# Altium project obdh2_project.prjpcb (part 1 of 2)
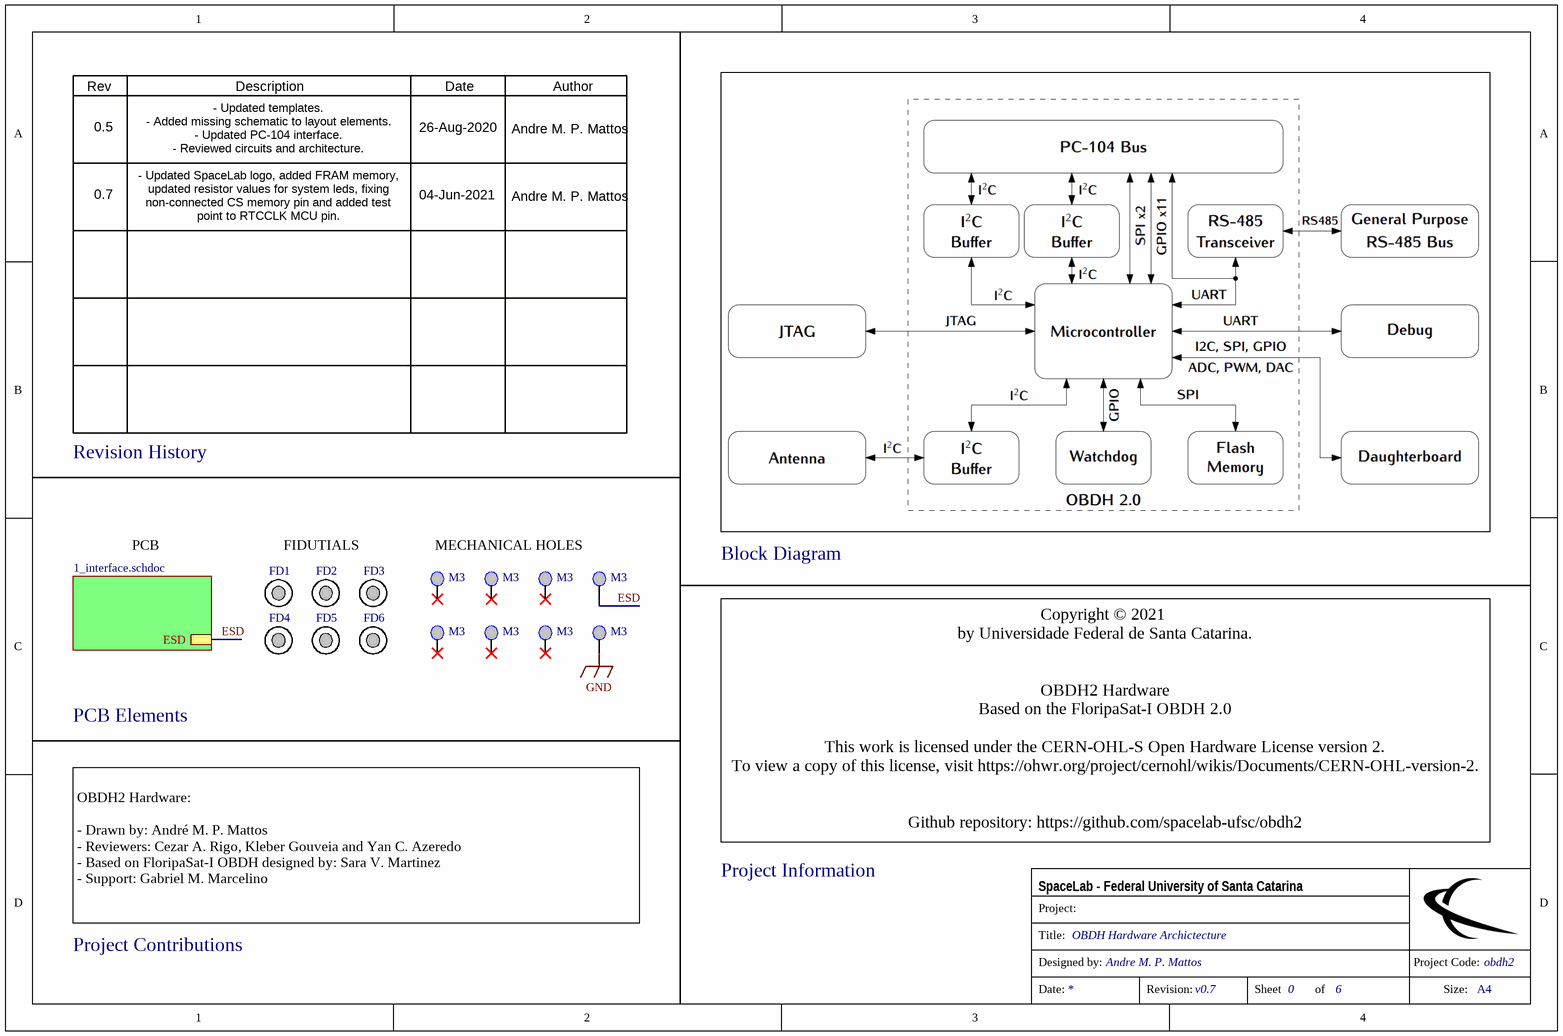
[diagram p0: 0_architecture.schdoc]
DesignedBy: Andre M. P. Mattos; ProductCode: OBDH2; Revision: 0.7
7 sheets, 199 parts. Net scope: hierarchical (ports join the sheet entries above them; power ports are global).
Board file: board_layout.pcbdoc
Sheets:
  0_architecture.schdoc
    Interface = 1_interface.schdoc
      Topology = 2_topology.schdoc
        MCU_OBDH = 3_mcu_main.schdoc
        Analog_Circuits = 4_analog_circuits.schdoc
        Non Volatile Memory = 5_non_volatile_memory.schdoc
        Communication Buffers = 6_communication_buffers.schdoc

## Sheet 0_architecture.schdoc: OBDH Hardware Archictecture
size A4; Revision: v0.7; SheetNumber: 0; SheetTotal: 6; ProjectCode: obdh2; Designed by: André M. P. Mattos; Version: v0.7

### Parts
FD1  Fiducial 1.3  [Fiducial 1.3mm]  (value not drawn)  (no BOM)
FD2  Fiducial 1.3  [Fiducial 1.3mm]  (value not drawn)  (no BOM)
FD3  Fiducial 1.3  [Fiducial 1.3mm]  (value not drawn)  (no BOM)
FD4  Fiducial 1.3  [Fiducial 1.3mm]  (value not drawn)  (no BOM)
FD5  Fiducial 1.3  [Fiducial 1.3mm]  (value not drawn)  (no BOM)
FD6  Fiducial 1.3  [Fiducial 1.3mm]  (value not drawn)  (no BOM)
MEC1  M3  [M3 hole]  (no BOM)
MEC2  M3  [M3 hole]  (no BOM)
MEC3  M3  [M3 hole]  (no BOM)
MEC4  M3  [M3 hole]  (no BOM)
MEC5  M3  [M3 hole]  (no BOM)
MEC6  M3  [M3 hole]  (no BOM)
MEC7  M3  [M3 hole]  (no BOM)
MEC8  M3  [M3 hole]  (no BOM)

### Sub-sheets
Interface = 1_interface.schdoc: ESD

### Nets
GND: MEC8.0
ESD: MEC4.0 ; sheet Interface/ESD

Not connected (* = marked no-connect by the designer): MEC1 0*; MEC2 0*; MEC3 0*; MEC5 0*; MEC6 0*; MEC7 0*

### Notes on the sheet
- Rev
- Description
- Date
- Author
- 0.5
- - Updated templates.
  - Added missing schematic to layout elements.
  - Updated PC-104 interface.
  - Reviewed circuits and architecture.
- 26-Aug-2020
- Andre M. P. Mattos
- 0.7
- - Updated SpaceLab logo, added FRAM memory, updated resistor values for system leds, fixing non-connected CS memory pin and added test point to RTCCLK MCU pin.
- 04-Jun-2021
- Revision History
- PCB
- FIDUTIALS
- MECHANICAL HOLES
- Block Diagram
- PCB Elements
- Copyright © 2021
  by Universidade Federal de Santa Catarina.
  OBDH2 Hardware
  Based on the FloripaSat-I OBDH 2.0
  This work is licensed under the CERN-OHL-S Open Hardware License version 2.
  To view a copy of this license, visit https://ohwr.org/project/cernohl/wikis/Documents/CERN-OHL-version-2.
  Github repository: https://github.com/spacelab-ufsc/obdh2
  More info about SpaceLab: https://spacelab.ufsc.br/
- OBDH2 Hardware:
  - Drawn by: André M. P. Mattos
  - Reviewers: Cezar A. Rigo, Kleber Gouveia and Yan C. Azeredo
  - Based on FloripaSat-I OBDH designed by: Sara V. Martinez
  - Support: Gabriel M. Marcelino
- Project Information
- Project Contributions
- Project:
- SpaceLab - Federal University of Santa Catarina
- Title:
- Designed by:
- Project Code:
- Date:
- Revision:
- Sheet
- of
- Size:
- A4

### Library data of the parts
FD1-FD6 = Fiducial 1.3: Fiducial 1.3mm
MEC1-MEC8 = M3 hole

## Sheet 1_interface.schdoc: OBDH Interface
size A3; Engineer: Eng_2_ALT; SheetNumber: 1; SheetTotal: 6; Designed by: André M. P. Mattos; Version: v0.5
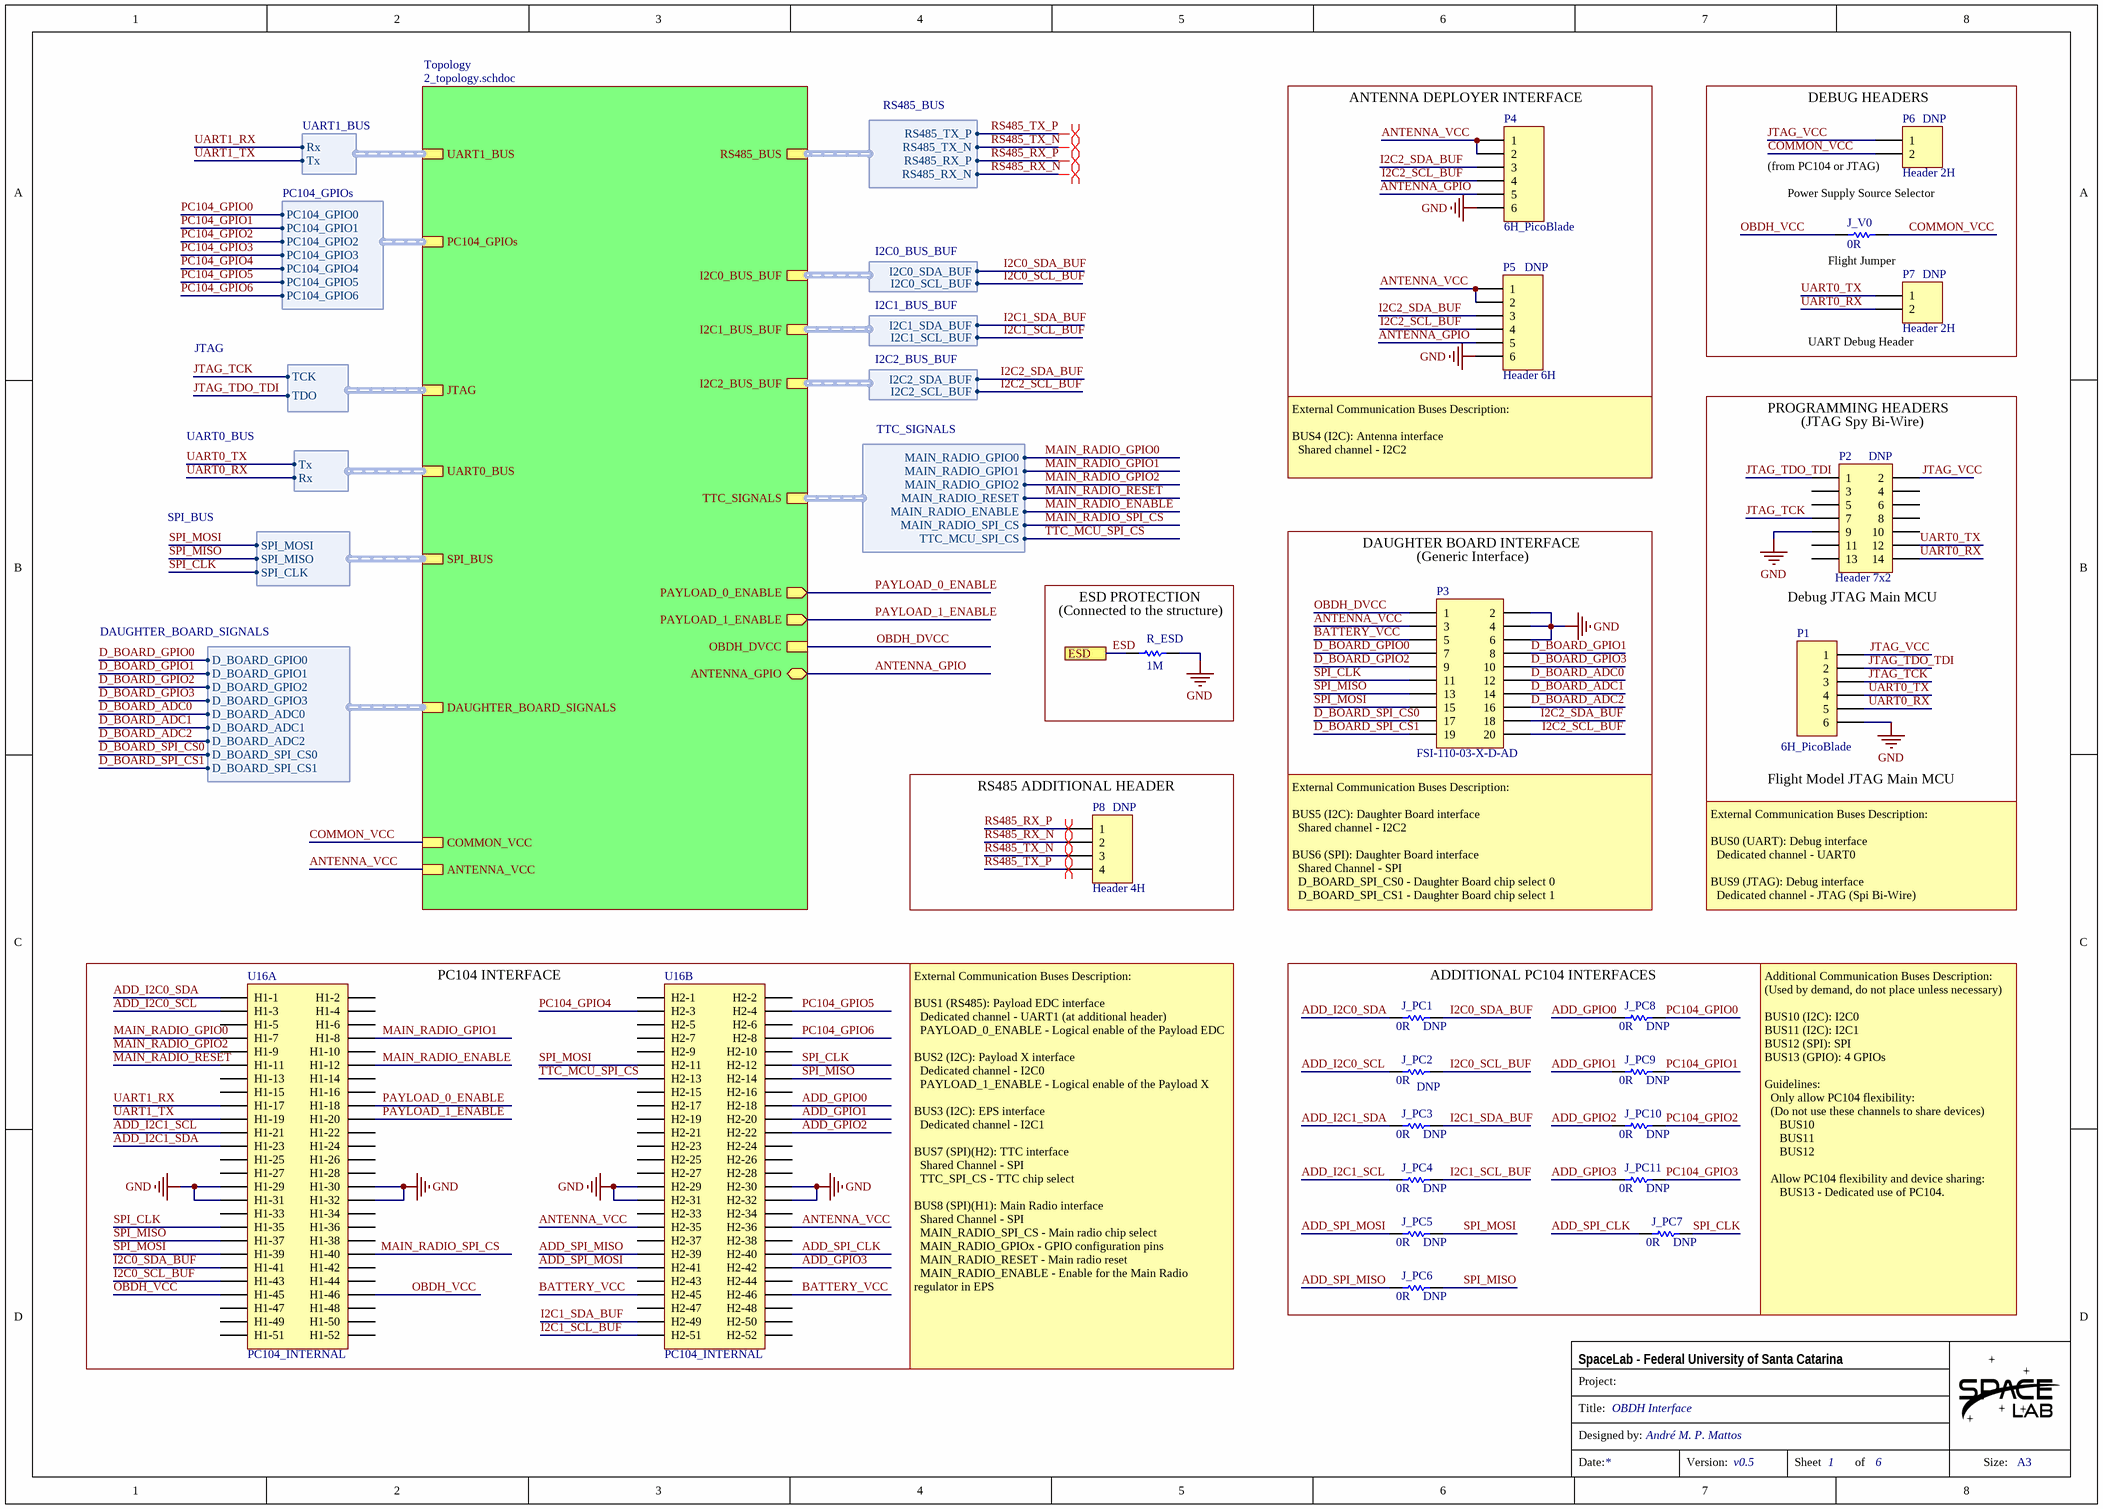
[diagram p1: 1_interface.schdoc]

### Parts
J_PC1  0R  [0805]
J_PC2  0R  [0805]
J_PC3  0R  [0805]
J_PC4  0R  [0805]
J_PC5  0R  [0805]
J_PC6  0R  [0805]
J_PC7  0R  [0805]
J_PC8  0R  [0805]
J_PC9  0R  [0805]
J_PC10  0R  [0805]
J_PC11  0R  [0805]
J_V0  0R  [0805]
P1  6H_PicoBlade  [HDR6 PicoBlade]
P2  Header 7x2  [HDR2X7]
P3  FSI-110-03-X-D-AD  [FSI-110-03-X-D-AD]
P4  6H_PicoBlade  [HDR6 PicoBlade]
P5  Header 6H  [HDR1X6H]
P6  Header 2H  [HDR 1X2]
P7  Header 2H  [HDR 1X2]
P8  Header 4H  [HDR1X4]
R_ESD  1M  [0805]
U16  PC104_INTERNAL  [PC104]  (parts A,B of 2)

### Blocks framed on the sheet
ANTENNA DEPLOYER INTERFACE: P4 P5
DEBUG HEADERS: J_V0 P6 P7
RS485 ADDITIONAL HEADER: P8
PC104 INTERFACE: U16
ADDITIONAL PC104 INTERFACES: J_PC1-J_PC11

### Sub-sheets
Topology = 2_topology.schdoc: PAYLOAD_0_ENABLE (out), PAYLOAD_1_ENABLE (out), ANTENNA_GPIO (bidir), UART0_BUS (harness UART0_BUS), JTAG (harness JTAG), RS485_BUS (harness RS485_BUS), I2C2_BUS_BUF (harness I2C2_BUS_BUF), I2C1_BUS_BUF (harness I2C1_BUS_BUF), I2C0_BUS_BUF (harness I2C0_BUS_BUF), SPI_BUS (harness SPI_BUS), TTC_SIGNALS (harness TTC_SIGNALS), ANTENNA_VCC, COMMON_VCC, DAUGHTER_BOARD_SIGNALS (harness DAUGHTER_BOARD_SIGNALS), OBDH_DVCC, PC104_GPIOs (harness PC104_GPIOs), UART1_BUS (harness UART1_BUS)

### Ports
ESD

### Harnesses
JTAG: TDO, TCK
UART0_BUS: Rx, Tx
I2C0_BUS_BUF: I2C0_SDA_BUF, I2C0_SCL_BUF
I2C2_BUS_BUF: I2C2_SDA_BUF, I2C2_SCL_BUF
I2C1_BUS_BUF: I2C1_SDA_BUF, I2C1_SCL_BUF
RS485_BUS: RS485_TX_P, RS485_TX_N, RS485_RX_P, RS485_RX_N
SPI_BUS: SPI_CLK, SPI_MISO, SPI_MOSI
TTC_SIGNALS: MAIN_RADIO_GPIO0, MAIN_RADIO_GPIO1, MAIN_RADIO_GPIO2, MAIN_RADIO_RESET, MAIN_RADIO_ENABLE, MAIN_RADIO_SPI_CS, TTC_MCU_SPI_CS
DAUGHTER_BOARD_SIGNALS: D_BOARD_GPIO3, D_BOARD_GPIO2, D_BOARD_ADC0, D_BOARD_ADC1, D_BOARD_GPIO1, D_BOARD_GPIO0, D_BOARD_ADC2, D_BOARD_SPI_CS0, D_BOARD_SPI_CS1
UART1_BUS: Rx, Tx
PC104_GPIOs: PC104_GPIO0, PC104_GPIO1, PC104_GPIO2, PC104_GPIO3, PC104_GPIO4, PC104_GPIO5, PC104_GPIO6

### Nets
ANTENNA_VCC: P3.3 P4.1 P4.2 P5.1 P5.2 U16.H2-35 U16.H2-36 ; sheet Topology/ANTENNA_VCC
GND: P1.6 P2.9 P3.2 P3.4 P3.6 P4.6 P5.6 R_ESD.1 U16.H1-29 U16.H1-30 U16.H1-31 U16.H1-32 U16.H2-29 U16.H2-30 U16.H2-31 U16.H2-32
OBDH_DVCC: P3.1 ; sheet Topology/OBDH_DVCC
ADD_GPIO0: J_PC8.1 U16.H2-18
ADD_GPIO1: J_PC9.1 U16.H2-20
ADD_GPIO2: J_PC10.1 U16.H2-22
ADD_GPIO3: J_PC11.1 U16.H2-42
ADD_I2C0_SCL: J_PC2.1 U16.H1-3
ADD_I2C0_SDA: J_PC1.1 U16.H1-1
ADD_I2C1_SCL: J_PC4.1 U16.H1-21
ADD_I2C1_SDA: J_PC3.1 U16.H1-23
ADD_SPI_CLK: J_PC7.1 U16.H2-40
ADD_SPI_MISO: J_PC6.1 U16.H2-39
ADD_SPI_MOSI: J_PC5.1 U16.H2-41
ANTENNA_GPIO: P4.5 P5.5 ; sheet Topology/ANTENNA_GPIO
BATTERY_VCC: P3.5 U16.H2-45 U16.H2-46
COMMON_VCC: J_V0.2 P6.2 ; sheet Topology/COMMON_VCC
D_BOARD_ADC0: P3.12 ; sheet Topology/DAUGHTER_BOARD_SIGNALS.D_BOARD_ADC0
D_BOARD_ADC1: P3.14 ; sheet Topology/DAUGHTER_BOARD_SIGNALS.D_BOARD_ADC1
D_BOARD_ADC2: P3.16 ; sheet Topology/DAUGHTER_BOARD_SIGNALS.D_BOARD_ADC2
D_BOARD_GPIO0: P3.7 ; sheet Topology/DAUGHTER_BOARD_SIGNALS.D_BOARD_GPIO0
D_BOARD_GPIO1: P3.8 ; sheet Topology/DAUGHTER_BOARD_SIGNALS.D_BOARD_GPIO1
D_BOARD_GPIO2: P3.9 ; sheet Topology/DAUGHTER_BOARD_SIGNALS.D_BOARD_GPIO2
D_BOARD_GPIO3: P3.10 ; sheet Topology/DAUGHTER_BOARD_SIGNALS.D_BOARD_GPIO3
D_BOARD_SPI_CS0: P3.17 ; sheet Topology/DAUGHTER_BOARD_SIGNALS.D_BOARD_SPI_CS0
D_BOARD_SPI_CS1: P3.19 ; sheet Topology/DAUGHTER_BOARD_SIGNALS.D_BOARD_SPI_CS1
ESD: R_ESD.2 ; port ESD
I2C0_SCL_BUF: J_PC2.2 U16.H1-43 ; sheet Topology/I2C0_BUS_BUF.I2C0_SCL_BUF
I2C0_SDA_BUF: J_PC1.2 U16.H1-41 ; sheet Topology/I2C0_BUS_BUF.I2C0_SDA_BUF
I2C1_SCL_BUF: J_PC4.2 U16.H2-51 ; sheet Topology/I2C1_BUS_BUF.I2C1_SCL_BUF
I2C1_SDA_BUF: J_PC3.2 U16.H2-49 ; sheet Topology/I2C1_BUS_BUF.I2C1_SDA_BUF
I2C2_SCL_BUF: P3.20 P4.4 P5.4 ; sheet Topology/I2C2_BUS_BUF.I2C2_SCL_BUF
I2C2_SDA_BUF: P3.18 P4.3 P5.3 ; sheet Topology/I2C2_BUS_BUF.I2C2_SDA_BUF
JTAG_TCK: P1.3 P2.7 ; sheet Topology/JTAG.TCK
JTAG_TDO_TDI: P1.2 P2.1 ; sheet Topology/JTAG.TDO
JTAG_VCC: P1.1 P2.2 P6.1
MAIN_RADIO_ENABLE: U16.H1-12 ; sheet Topology/TTC_SIGNALS.MAIN_RADIO_ENABLE
MAIN_RADIO_GPIO0: U16.H1-7 ; sheet Topology/TTC_SIGNALS.MAIN_RADIO_GPIO0
MAIN_RADIO_GPIO1: U16.H1-8 ; sheet Topology/TTC_SIGNALS.MAIN_RADIO_GPIO1
MAIN_RADIO_GPIO2: U16.H1-9 ; sheet Topology/TTC_SIGNALS.MAIN_RADIO_GPIO2
MAIN_RADIO_RESET: U16.H1-11 ; sheet Topology/TTC_SIGNALS.MAIN_RADIO_RESET
MAIN_RADIO_SPI_CS: U16.H1-40 ; sheet Topology/TTC_SIGNALS.MAIN_RADIO_SPI_CS
OBDH_VCC: J_V0.1 U16.H1-45 U16.H1-46
PAYLOAD_0_ENABLE: U16.H1-18 ; sheet Topology/PAYLOAD_0_ENABLE
PAYLOAD_1_ENABLE: U16.H1-20 ; sheet Topology/PAYLOAD_1_ENABLE
PC104_GPIO0: J_PC8.2 ; sheet Topology/PC104_GPIOs.PC104_GPIO0
PC104_GPIO1: J_PC9.2 ; sheet Topology/PC104_GPIOs.PC104_GPIO1
PC104_GPIO2: J_PC10.2 ; sheet Topology/PC104_GPIOs.PC104_GPIO2
PC104_GPIO3: J_PC11.2 ; sheet Topology/PC104_GPIOs.PC104_GPIO3
PC104_GPIO4: U16.H2-3 ; sheet Topology/PC104_GPIOs.PC104_GPIO4
PC104_GPIO5: U16.H2-4 ; sheet Topology/PC104_GPIOs.PC104_GPIO5
PC104_GPIO6: U16.H2-8 ; sheet Topology/PC104_GPIOs.PC104_GPIO6
RS485_RX_N: P8.2 ; sheet Topology/RS485_BUS.RS485_RX_N
RS485_RX_P: P8.1 ; sheet Topology/RS485_BUS.RS485_RX_P
RS485_TX_N: P8.3 ; sheet Topology/RS485_BUS.RS485_TX_N
RS485_TX_P: P8.4 ; sheet Topology/RS485_BUS.RS485_TX_P
SPI_CLK: J_PC7.2 P3.11 U16.H1-35 U16.H2-12 ; sheet Topology/SPI_BUS.SPI_CLK
SPI_MISO: J_PC6.2 P3.13 U16.H1-37 U16.H2-14 ; sheet Topology/SPI_BUS.SPI_MISO
SPI_MOSI: J_PC5.2 P3.15 U16.H1-39 U16.H2-11 ; sheet Topology/SPI_BUS.SPI_MOSI
TTC_MCU_SPI_CS: U16.H2-13 ; sheet Topology/TTC_SIGNALS.TTC_MCU_SPI_CS
UART0_RX: P1.5 P2.14 P7.2 ; sheet Topology/UART0_BUS.Rx
UART0_TX: P1.4 P2.12 P7.1 ; sheet Topology/UART0_BUS.Tx
UART1_RX: U16.H1-17 ; sheet Topology/UART1_BUS.Rx
UART1_TX: U16.H1-19 ; sheet Topology/UART1_BUS.Tx

Not connected (* = marked no-connect by the designer): P2 3 4 5 6 8 10 11 13; U16 H1-2 H1-4 H1-5 H1-6 H1-10 H1-13 H1-14 H1-15 H1-16 H1-22 H1-24 H1-25 H1-26 H1-27 H1-28 H1-33 H1-34 H1-36 H1-38 H1-42 H1-44 H1-47 H1-48 H1-49 H1-50 H1-51 H1-52 H2-1 H2-2 H2-5 H2-6 H2-7 H2-9 H2-10 H2-15 H2-16 H2-17 H2-19 H2-21 H2-23 H2-24 H2-25 H2-26 H2-27 H2-28 H2-33 H2-34 H2-37 H2-38 H2-43 H2-44 H2-47 H2-48 H2-50 H2-52

### Layout directives
differential pair: RS485_RX_N, RS485_RX_P, RS485_TX_N, RS485_TX_P

### Notes on the sheet
- (near P6) (from PC104 or JTAG)
- (near P6) DNP
- Power Supply Source Selector
- (near P5) DNP
- Flight Jumper
- (near P7) DNP
- (near P7) UART Debug Header
- PROGRAMMING HEADERS
- (near P2) (JTAG Spy Bi-Wire)
- (near P5) External Communication Buses Description:
  BUS4 (I2C): Antenna interface
  Shared channel - I2C2
- (near P2) DNP
- DAUGHTER BOARD INTERFACE
- (near P3) (Generic Interface)
- (near R_ESD) (Connected to the structure)
- (near R_ESD) ESD PROTECTION
- Debug JTAG Main MCU
- (near P1) Flight Model JTAG Main MCU
- (near P8) DNP
- (near P3) External Communication Buses Description:
  BUS5 (I2C): Daughter Board interface
  Shared channel - I2C2
  BUS6 (SPI): Daughter Board interface
  Shared Channel - SPI
  D_BOARD_SPI_CS0 - Daughter Board chip select 0
  D_BOARD_SPI_CS1 - Daughter Board chip select 1
- External Communication Buses Description:
  BUS0 (UART): Debug interface
  Dedicated channel - UART0
  BUS9 (JTAG): Debug interface
  Dedicated channel - JTAG (Spi Bi-Wire)
- (near J_PC1) DNP
- (near J_PC8) DNP
- (near J_PC2) DNP
- (near J_PC9) DNP
- (near J_PC3) DNP
- (near J_PC4) DNP
- (near J_PC10) DNP
- (near J_PC11) DNP
- (near J_PC5) DNP
- (near J_PC7) DNP
- (near J_PC6) DNP
- Additional Communication Buses Description:
  (Used by demand, do not place unless necessary)
  BUS10 (I2C): I2C0
  BUS11 (I2C): I2C1
  BUS12 (SPI): SPI
  BUS13 (GPIO): 4 GPIOs
  Guidelines:
  Only allow PC104 flexibility:
  (Do not use these channels to share devices)
  BUS10
  BUS11
  BUS12
  Allow PC104 flexibility and device sharing:
  BUS13 - Dedicated use of PC104.
- External Communication Buses Description:
  BUS1 (RS485): Payload EDC interface
  Dedicated channel - UART1 (at additional header)
  PAYLOAD_0_ENABLE - Logical enable of the Payload EDC
  BUS2 (I2C): Payload X interface
  Dedicated channel - I2C0
  PAYLOAD_1_ENABLE - Logical enable of the Payload X
  BUS3 (I2C): EPS interface
  Dedicated channel - I2C1
  BUS7 (SPI)(H2): TTC interface
  Shared Channel - SPI
  TTC_SPI_CS - TTC chip select
  BUS8 (SPI)(H1): Main Radio interface
  Shared Channel - SPI
  MAIN_RADIO_SPI_CS - Main radio chip select
  MAIN_RADIO_GPIOx - GPIO configuration pins
  MAIN_RADIO_RESET - Main radio reset
  MAIN_RADIO_ENABLE - Enable for the Main Radio regulator in EPS
- Project:
- SpaceLab - Federal University of Santa Catarina
- Title:
- Designed by:
- Date:
- Version:
- Sheet
- of
- Size:
- A3

### Library data of the parts
J_PC1-J_PC11 J_V0 = R0R_JUMPER_1/16W_0805: RES 0R OHM 1/16W JUMPER 0805; Partnumber: CRCW08050000Z0EA; NCM: 8533.21.20
P1 P4 = Header 6H_PicoBlade: Header, 6-Pin, Right Angle; Partnumber: 53398-0671; LatestRevisionDate: 17-Jul-2002; LatestRevisionNote: Re-released for DXP Platform.; Publisher: Altium Limited
P2 = Header 7X2: Header, 7-Pin, Dual row; LatestRevisionDate: 17-Jul-2002; LatestRevisionNote: Re-released for DXP Platform.; Publisher: Altium Limited
P3 = FSI-110-03-X-D-AD: Contact Connector; Partnumber: FSI-110-03-G-D-AD; Value: *
P5 = Header 6H: Header, 6-Pin, Right Angle; LatestRevisionDate: 17-Jul-2002; LatestRevisionNote: Re-released for DXP Platform.; Publisher: Altium Limited
P6 P7 = Header 2: Header, 2-Pin; PartNumber: 826646-2; LatestRevisionDate: 17-Jul-2002; LatestRevisionNote: Re-released for DXP Platform.; Publisher: Altium Limited
P8 = Header 4H: Header, 4-Pin; LatestRevisionDate: 17-Jul-2002; LatestRevisionNote: Re-released for DXP Platform.; Publisher: Altium Limited
R_ESD = R1000k_1%_1/8W_0805: RES 1000K OHM 1/8W 1% 0805; Partnumber: AC0805FR-13100KL; NCM: 8533.21.20
U16 = PC104: Partnumber: SSW-126-04-G-D

## Sheet 2_topology.schdoc: OBDH Topology
size A3; Engineer: Eng_2_ALT; SheetNumber: 2; SheetTotal: 6; Designed by: André M. P. Mattos; Version: v0.7; ProjectRevision: v0.7; ProjectCode: obdh2
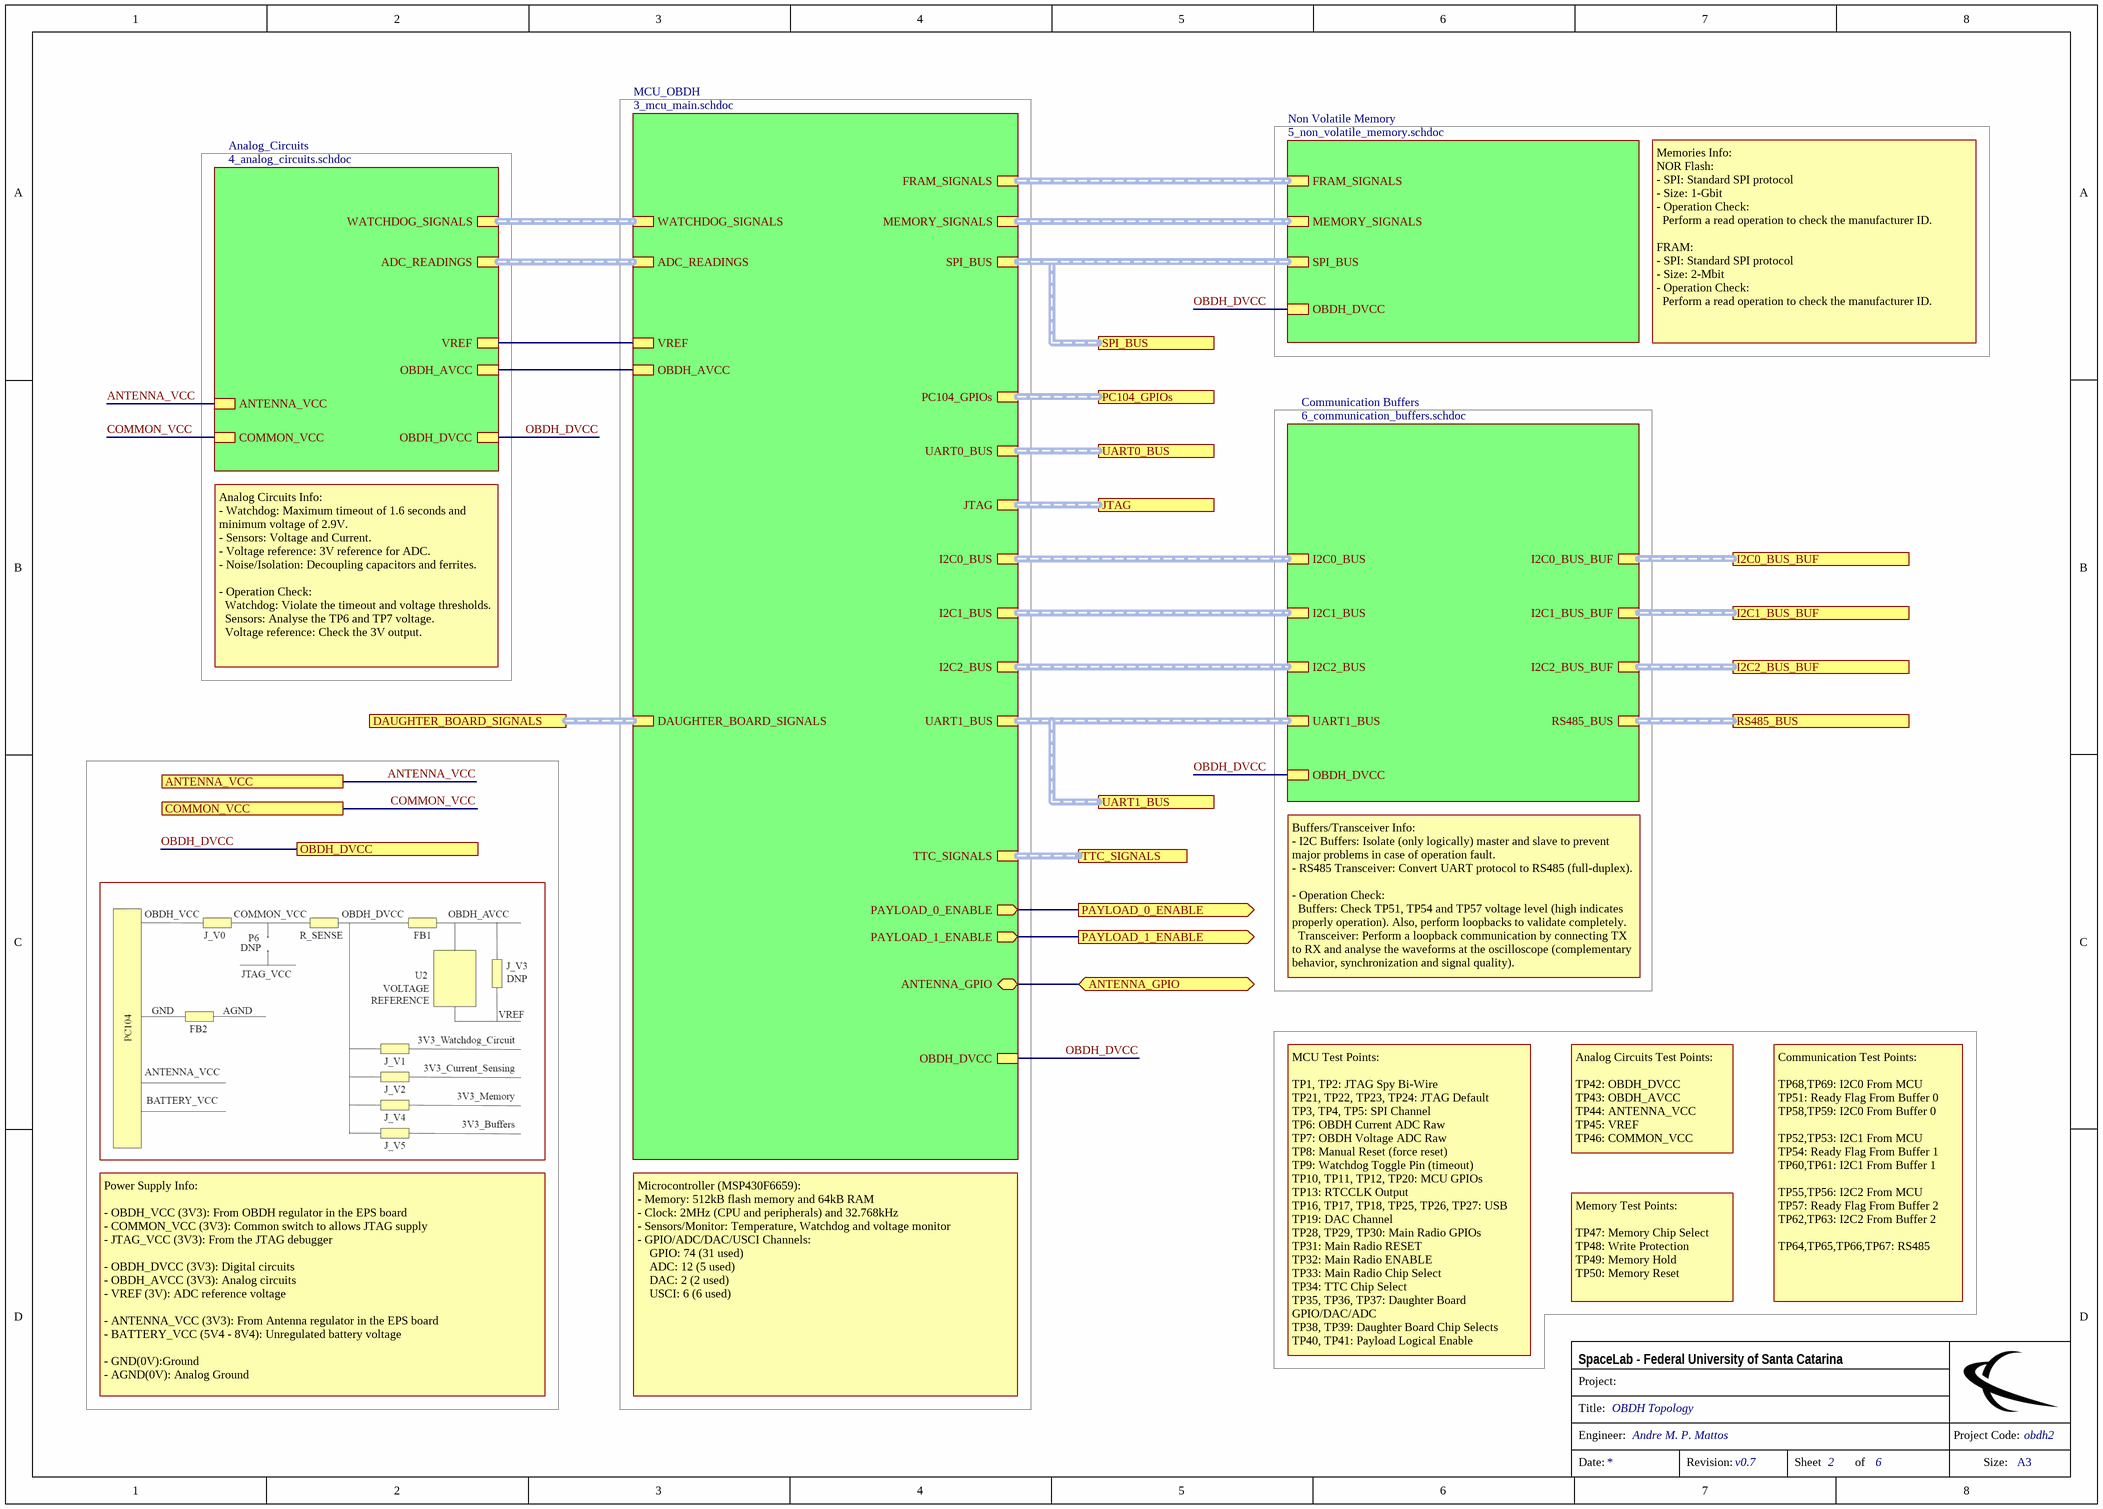
[diagram p2: 2_topology.schdoc]

### Sub-sheets
Analog_Circuits = 4_analog_circuits.schdoc: COMMON_VCC, ADC_READINGS (harness ADC_READINGS), OBDH_DVCC, ANTENNA_VCC, OBDH_AVCC, VREF, WATCHDOG_SIGNALS (harness WATCHDOG_SIGNALS)
Communication Buffers = 6_communication_buffers.schdoc: OBDH_DVCC, I2C0_BUS (harness I2C0_BUS), I2C1_BUS (harness I2C1_BUS), I2C2_BUS (harness I2C2_BUS), UART1_BUS (harness UART1_BUS), RS485_BUS (harness RS485_BUS), I2C0_BUS_BUF (harness I2C0_BUS_BUF), I2C1_BUS_BUF (harness I2C1_BUS_BUF), I2C2_BUS_BUF (harness I2C2_BUS_BUF)
MCU_OBDH = 3_mcu_main.schdoc: JTAG (harness JTAG), UART0_BUS (harness UART0_BUS), PAYLOAD_0_ENABLE (out), ADC_READINGS (harness ADC_READINGS), PAYLOAD_1_ENABLE (out), I2C2_BUS (harness I2C2_BUS), I2C0_BUS (harness I2C0_BUS), ANTENNA_GPIO (bidir), UART1_BUS (harness UART1_BUS), I2C1_BUS (harness I2C1_BUS), SPI_BUS (harness SPI_BUS), TTC_SIGNALS (harness TTC_SIGNALS), OBDH_AVCC, VREF, WATCHDOG_SIGNALS (harness WATCHDOG_SIGNALS), OBDH_DVCC, DAUGHTER_BOARD_SIGNALS (harness DAUGHTER_BOARD_SIGNALS), PC104_GPIOs (harness PC104_GPIOs), MEMORY_SIGNALS (harness MEMORY_SIGNALS), FRAM_SIGNALS (harness FRAM_SIGNALS)
Non Volatile Memory = 5_non_volatile_memory.schdoc: OBDH_DVCC, SPI_BUS (harness SPI_BUS), MEMORY_SIGNALS (harness MEMORY_SIGNALS), FRAM_SIGNALS (harness FRAM_SIGNALS)

### Ports
ANTENNA_GPIO (bidir), ANTENNA_VCC, COMMON_VCC, DAUGHTER_BOARD_SIGNALS (harness DAUGHTER_BOARD_SIGNALS), I2C0_BUS_BUF (harness I2C0_BUS), I2C1_BUS_BUF (harness I2C0_BUS), I2C2_BUS_BUF (harness I2C2_BUS), JTAG (harness TTC_SIGNALS), OBDH_DVCC, PAYLOAD_0_ENABLE (out), PAYLOAD_1_ENABLE (out), PC104_GPIOs (harness TTC_SIGNALS), RS485_BUS (harness I2C2_BUS), SPI_BUS (harness I2C0_BUS), TTC_SIGNALS (harness TTC_SIGNALS), UART0_BUS (harness TTC_SIGNALS), UART1_BUS (harness I2C0_BUS)

### Nets
ANTENNA_VCC: port ANTENNA_VCC, sheet Analog_Circuits/ANTENNA_VCC
OBDH_AVCC: sheet MCU_OBDH/OBDH_AVCC, sheet Analog_Circuits/OBDH_AVCC
OBDH_DVCC: port OBDH_DVCC, sheet MCU_OBDH/OBDH_DVCC, sheet Analog_Circuits/OBDH_DVCC, sheet Non Volatile Memory/OBDH_DVCC, sheet Communication Buffers/OBDH_DVCC
ANTENNA_GPIO: port ANTENNA_GPIO, sheet MCU_OBDH/ANTENNA_GPIO
COMMON_VCC: port COMMON_VCC, sheet Analog_Circuits/COMMON_VCC
PAYLOAD_0_ENABLE: port PAYLOAD_0_ENABLE, sheet MCU_OBDH/PAYLOAD_0_ENABLE
PAYLOAD_1_ENABLE: port PAYLOAD_1_ENABLE, sheet MCU_OBDH/PAYLOAD_1_ENABLE
VREF: sheet MCU_OBDH/VREF, sheet Analog_Circuits/VREF

### Buses and harness runs
harness port DAUGHTER_BOARD_SIGNALS = sheet MCU_OBDH/DAUGHTER_BOARD_SIGNALS
harness port I2C0_BUS_BUF = sheet Communication Buffers/I2C0_BUS_BUF
harness port I2C1_BUS_BUF = sheet Communication Buffers/I2C1_BUS_BUF
harness port I2C2_BUS_BUF = sheet Communication Buffers/I2C2_BUS_BUF
harness port JTAG = sheet MCU_OBDH/JTAG
harness port PC104_GPIOs = sheet MCU_OBDH/PC104_GPIOs
harness port RS485_BUS = sheet Communication Buffers/RS485_BUS
harness port SPI_BUS = sheet MCU_OBDH/SPI_BUS = sheet Non Volatile Memory/SPI_BUS
harness port TTC_SIGNALS = sheet MCU_OBDH/TTC_SIGNALS
harness port UART0_BUS = sheet MCU_OBDH/UART0_BUS
harness port UART1_BUS = sheet Communication Buffers/UART1_BUS = sheet MCU_OBDH/UART1_BUS
harness sheet Analog_Circuits/ADC_READINGS = sheet MCU_OBDH/ADC_READINGS
harness sheet Analog_Circuits/WATCHDOG_SIGNALS = sheet MCU_OBDH/WATCHDOG_SIGNALS
harness sheet Communication Buffers/I2C0_BUS = sheet MCU_OBDH/I2C0_BUS
harness sheet Communication Buffers/I2C1_BUS = sheet MCU_OBDH/I2C1_BUS
harness sheet Communication Buffers/I2C2_BUS = sheet MCU_OBDH/I2C2_BUS
harness sheet MCU_OBDH/FRAM_SIGNALS = sheet Non Volatile Memory/FRAM_SIGNALS
harness sheet MCU_OBDH/MEMORY_SIGNALS = sheet Non Volatile Memory/MEMORY_SIGNALS

### Notes on the sheet
- Memories Info:
  NOR Flash:
  - SPI: Standard SPI protocol
  - Size: 1-Gbit
  - Operation Check:
  Perform a read operation to check the manufacturer ID.
  FRAM:
  - SPI: Standard SPI protocol
  - Size: 2-Mbit
  - Operation Check:
  Perform a read operation to check the manufacturer ID.
- Analog Circuits Info:
  - Watchdog: Maximum timeout of 1.6 seconds and minimum voltage of 2.9V.
  - Sensors: Voltage and Current.
  - Voltage reference: 3V reference for ADC.
  - Noise/Isolation: Decoupling capacitors and ferrites.
  - Operation Check:
  Watchdog: Violate the timeout and voltage thresholds.
  Sensors: Analyse the TP6 and TP7 voltage.
  Voltage reference: Check the 3V output.
- Buffers/Transceiver Info:
  - I2C Buffers: Isolate (only logically) master and slave to prevent major problems in case of operation fault.
  - RS485 Transceiver: Convert UART protocol to RS485 (full-duplex).
  - Operation Check:
  Buffers: Check TP51, TP54 and TP57 voltage level (high indicates properly operation). Also, perform loopbacks to validate completely.
  Transceiver: Perform a loopback communication by connecting TX to RX and analyse the waveforms at the oscilloscope (complementary behavior, synchronization and signal quality).
- Analog Circuits Test Points:
  TP42: OBDH_DVCC
  TP43: OBDH_AVCC
  TP44: ANTENNA_VCC
  TP45: VREF
  TP46: COMMON_VCC
- Memory Test Points:
  TP47: Memory Chip Select
  TP48: Write Protection
  TP49: Memory Hold
  TP50: Memory Reset
- Communication Test Points:
  TP68,TP69: I2C0 From MCU
  TP51: Ready Flag From Buffer 0
  TP58,TP59: I2C0 From Buffer 0
  TP52,TP53: I2C1 From MCU
  TP54: Ready Flag From Buffer 1
  TP60,TP61: I2C1 From Buffer 1
  TP55,TP56: I2C2 From MCU
  TP57: Ready Flag From Buffer 2
  TP62,TP63: I2C2 From Buffer 2
  TP64,TP65,TP66,TP67: RS485
- Power Supply Info:
  - OBDH_VCC (3V3): From OBDH regulator in the EPS board
  - COMMON_VCC (3V3): Common switch to allows JTAG supply
  - JTAG_VCC (3V3): From the JTAG debugger
  - OBDH_DVCC (3V3): Digital circuits
  - OBDH_AVCC (3V3): Analog circuits
  - VREF (3V): ADC reference voltage
  - ANTENNA_VCC (3V3): From Antenna regulator in the EPS board
  - BATTERY_VCC (5V4 - 8V4): Unregulated battery voltage
  - GND(0V):Ground
  - AGND(0V): Analog Ground
- Microcontroller (MSP430F6659):
  - Memory: 512kB flash memory and 64kB RAM
  - Clock: 2MHz (CPU and peripherals) and 32.768kHz
  - Sensors/Monitor: Temperature, Watchdog and voltage monitor
  - GPIO/ADC/DAC/USCI Channels:
  GPIO: 74 (31 used)
  ADC: 12 (5 used)
  DAC: 2 (2 used)
  USCI: 6 (6 used)
- MCU Test Points:
  TP1, TP2: JTAG Spy Bi-Wire
  TP21, TP22, TP23, TP24: JTAG Default
  TP3, TP4, TP5: SPI Channel
  TP6: OBDH Current ADC Raw
  TP7: OBDH Voltage ADC Raw
  TP8: Manual Reset (force reset)
  TP9: Watchdog Toggle Pin (timeout)
  TP10, TP11, TP12, TP20: MCU GPIOs
  TP13: RTCCLK Output
  TP16, TP17, TP18, TP25, TP26, TP27: USB
  TP19: DAC Channel
  TP28, TP29, TP30: Main Radio GPIOs
  TP31: Main Radio RESET
  TP32: Main Radio ENABLE
  TP33: Main Radio Chip Select
  TP34: TTC Chip Select
  TP35, TP36, TP37: Daughter Board GPIO/DAC/ADC
  TP38, TP39: Daughter Board Chip Selects
  TP40, TP41: Payload Logical Enable
- Project:
- SpaceLab - Federal University of Santa Catarina
- Title:
- Engineer:
- Project Code:
- Date:
- Revision:
- Sheet
- of
- Size:
- A3

## Sheet 3_mcu_main.schdoc: OBDH MCU Main
size A3; Engineer: Eng_2_ALT; SheetNumber: 3; SheetTotal: 6; Designed by: André M. P. Mattos; Version: v0.7; ProjectRevision: v0.7; ProjectCode: obdh2
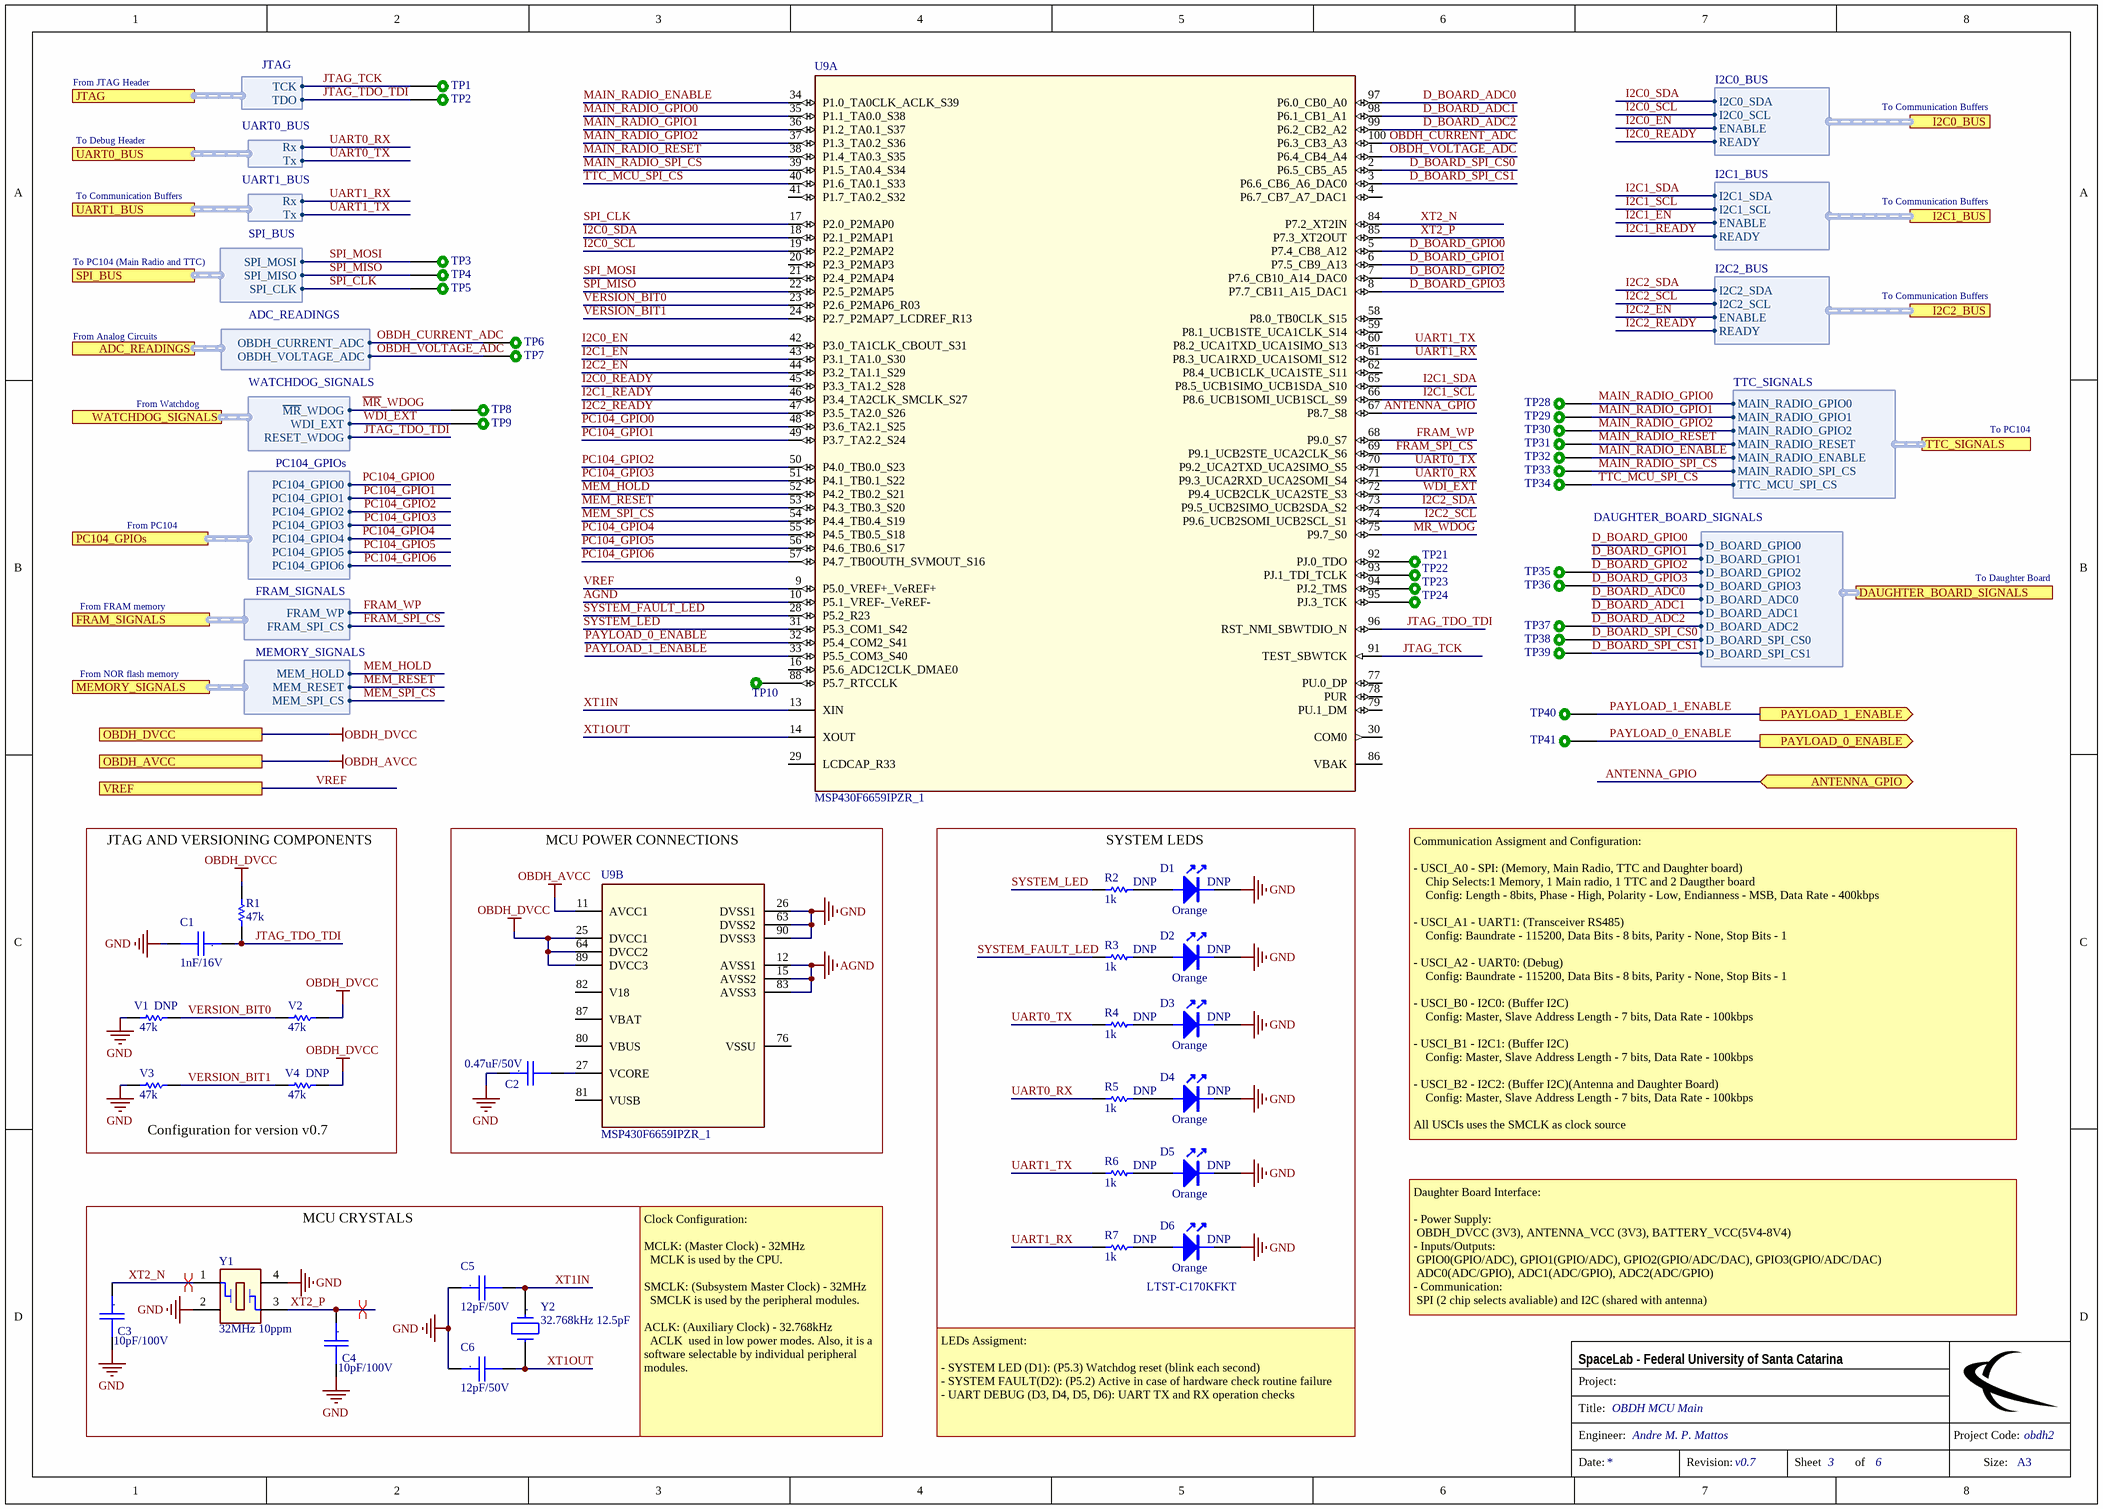
[diagram p3: 3_mcu_main.schdoc]

### Parts
C1  1nF/16V  [CC0805]
C2  0.47uF/50V  [CC0805]
C3  10pF/100V  [CC0805]
C4  10pF/100V  [CC0805]
C5  12pF/50V  [CC0805]
C6  12pF/50V  [CC0805]
D1  Orange  [0805-LED]
D2  Orange  [0805-LED]
D3  Orange  [0805-LED]
D4  Orange  [0805-LED]
D5  Orange  [0805-LED]
D6  Orange  [0805-LED]
R1  47k  [0805]
R2  1k  [0805]
R3  1k  [0805]
R4  1k  [0805]
R5  1k  [0805]
R6  1k  [0805]
R7  1k  [0805]
TP1  TEST_POINT_2  [TEST_POINT_2]  (value not drawn)  (no BOM)
TP2  TEST_POINT_2  [TEST_POINT_2]  (value not drawn)  (no BOM)
TP3  TEST_POINT_2  [TEST_POINT_2]  (value not drawn)  (no BOM)
TP4  TEST_POINT_2  [TEST_POINT_2]  (value not drawn)  (no BOM)
TP5  TEST_POINT_2  [TEST_POINT_2]  (value not drawn)  (no BOM)
TP6  TEST_POINT_2  [TEST_POINT_2]  (value not drawn)  (no BOM)
TP7  TEST_POINT_2  [TEST_POINT_2]  (value not drawn)  (no BOM)
TP8  TEST_POINT_2  [TEST_POINT_2]  (value not drawn)  (no BOM)
TP9  TEST_POINT_2  [TEST_POINT_2]  (value not drawn)  (no BOM)
TP10  TEST_POINT_2  [TEST_POINT_2]  (value not drawn)  (no BOM)
TP21  TEST_POINT_2  [TEST_POINT_2]  (value not drawn)  (no BOM)
TP22  TEST_POINT_2  [TEST_POINT_2]  (value not drawn)  (no BOM)
TP23  TEST_POINT_2  [TEST_POINT_2]  (value not drawn)  (no BOM)
TP24  TEST_POINT_2  [TEST_POINT_2]  (value not drawn)  (no BOM)
TP28  TEST_POINT_2  [TEST_POINT_2]  (value not drawn)  (no BOM)
TP29  TEST_POINT_2  [TEST_POINT_2]  (value not drawn)  (no BOM)
TP30  TEST_POINT_2  [TEST_POINT_2]  (value not drawn)  (no BOM)
TP31  TEST_POINT_2  [TEST_POINT_2]  (value not drawn)  (no BOM)
TP32  TEST_POINT_2  [TEST_POINT_2]  (value not drawn)  (no BOM)
TP33  TEST_POINT_2  [TEST_POINT_2]  (value not drawn)  (no BOM)
TP34  TEST_POINT_2  [TEST_POINT_2]  (value not drawn)  (no BOM)
TP35  TEST_POINT_2  [TEST_POINT_2]  (value not drawn)  (no BOM)
TP36  TEST_POINT_2  [TEST_POINT_2]  (value not drawn)  (no BOM)
TP37  TEST_POINT_2  [TEST_POINT_2]  (value not drawn)  (no BOM)
TP38  TEST_POINT_2  [TEST_POINT_2]  (value not drawn)  (no BOM)
TP39  TEST_POINT_2  [TEST_POINT_2]  (value not drawn)  (no BOM)
TP40  TEST_POINT_2  [TEST_POINT_2]  (value not drawn)  (no BOM)
TP41  TEST_POINT_2  [TEST_POINT_2]  (value not drawn)  (no BOM)
U9  MSP430F6659IPZR_1  [PZ0100A_N]  (parts A,B of 2)
V1  47k  [0805]
V2  47k  [0805]
V3  47k  [0805]
V4  47k  [0805]
Y1  32MHz 10ppm  [XTAL_ABM8X]
Y2  32.768kHz 12.5pF  [ABS06 0805]

### Blocks framed on the sheet
MCU POWER CONNECTIONS: C2 U9
SYSTEM LEDS: D1-D6 R2-R7
MCU CRYSTALS: C3-C6 Y1 Y2

### Ports
ADC_READINGS (harness ADC_READINGS), ANTENNA_GPIO (bidir), DAUGHTER_BOARD_SIGNALS (harness DAUGHTER_BOARD_SIGNALS), FRAM_SIGNALS (harness FRAM_SIGNALS), I2C0_BUS (harness I2C0_BUS), I2C1_BUS (harness I2C1_BUS), I2C2_BUS (harness I2C2_BUS), JTAG (harness JTAG), MEMORY_SIGNALS (harness MEMORY_SIGNALS), OBDH_AVCC, OBDH_DVCC, PAYLOAD_0_ENABLE (out), PAYLOAD_1_ENABLE (out), PC104_GPIOs (harness PC104_GPIOs), SPI_BUS (harness SPI_BUS), TTC_SIGNALS (harness TTC_SIGNALS), UART0_BUS (harness UART0_BUS), UART1_BUS (harness UART1_BUS), VREF, WATCHDOG_SIGNALS (harness WATCHDOG_SIGNALS)

### Harnesses
JTAG: TDO, TCK
UART0_BUS: Rx, Tx
ADC_READINGS: OBDH_CURRENT_ADC, OBDH_VOLTAGE_ADC
UART1_BUS: Rx, Tx
I2C0_BUS: I2C0_SCL, I2C0_SDA, ENABLE, READY
I2C1_BUS: I2C1_SCL, I2C1_SDA, ENABLE, READY
I2C2_BUS: I2C2_SCL, I2C2_SDA, ENABLE, READY
SPI_BUS: SPI_CLK, SPI_MISO, SPI_MOSI
TTC_SIGNALS: MAIN_RADIO_GPIO0, MAIN_RADIO_GPIO1, MAIN_RADIO_GPIO2, MAIN_RADIO_RESET, MAIN_RADIO_ENABLE, MAIN_RADIO_SPI_CS, TTC_MCU_SPI_CS
DAUGHTER_BOARD_SIGNALS: D_BOARD_GPIO3, D_BOARD_GPIO2, D_BOARD_ADC0, D_BOARD_ADC1, D_BOARD_GPIO1, D_BOARD_GPIO0, D_BOARD_ADC2, D_BOARD_SPI_CS0, D_BOARD_SPI_CS1
WATCHDOG_SIGNALS: ~{MR}_WDOG, WDI_EXT, RESET_WDOG
PC104_GPIOs: PC104_GPIO0, PC104_GPIO1, PC104_GPIO2, PC104_GPIO3, PC104_GPIO4, PC104_GPIO5, PC104_GPIO6
MEMORY_SIGNALS: MEM_SPI_CS, MEM_RESET, MEM_HOLD
FRAM_SIGNALS: FRAM_SPI_CS, FRAM_WP

### Nets
AGND: U9.10(P5.1_VREF-_VeREF-) U9.12(AVSS1) U9.15(AVSS2) U9.83(AVSS3)
GND: C1.2 C2.1 C3.2 C4.2 C5.1 C6.1 D1.2(K) D2.2(K) D3.2(K) D4.2(K) D5.2(K) D6.2(K) U9.26(DVSS1) U9.63(DVSS2) U9.90(DVSS3) V1.2 V3.2 Y1.2 Y1.4
OBDH_AVCC: U9.11(AVCC1) ; port OBDH_AVCC
OBDH_DVCC: R1.2 U9.25(DVCC1) U9.64(DVCC2) U9.89(DVCC3) V2.1 V4.1 ; port OBDH_DVCC
~{MR}_WDOG: TP8.1 U9.75(P9.7_S0) ; port WATCHDOG_SIGNALS.~{MR}_WDOG
ANTENNA_GPIO: U9.67(P8.7_S8) ; port ANTENNA_GPIO
D_BOARD_ADC0: U9.97(P6.0_CB0_A0) ; port DAUGHTER_BOARD_SIGNALS.D_BOARD_ADC0
D_BOARD_ADC1: U9.98(P6.1_CB1_A1) ; port DAUGHTER_BOARD_SIGNALS.D_BOARD_ADC1
D_BOARD_ADC2: TP37.1 U9.99(P6.2_CB2_A2) ; port DAUGHTER_BOARD_SIGNALS.D_BOARD_ADC2
D_BOARD_GPIO0: U9.5(P7.4_CB8_A12) ; port DAUGHTER_BOARD_SIGNALS.D_BOARD_GPIO0
D_BOARD_GPIO1: U9.6(P7.5_CB9_A13) ; port DAUGHTER_BOARD_SIGNALS.D_BOARD_GPIO1
D_BOARD_GPIO2: TP35.1 U9.7(P7.6_CB10_A14_DAC0) ; port DAUGHTER_BOARD_SIGNALS.D_BOARD_GPIO2
D_BOARD_GPIO3: TP36.1 U9.8(P7.7_CB11_A15_DAC1) ; port DAUGHTER_BOARD_SIGNALS.D_BOARD_GPIO3
D_BOARD_SPI_CS0: TP38.1 U9.2(P6.5_CB5_A5) ; port DAUGHTER_BOARD_SIGNALS.D_BOARD_SPI_CS0
D_BOARD_SPI_CS1: TP39.1 U9.3(P6.6_CB6_A6_DAC0) ; port DAUGHTER_BOARD_SIGNALS.D_BOARD_SPI_CS1
FRAM_SPI_CS: U9.69(P9.1_UCB2STE_UCA2CLK_S6) ; port FRAM_SIGNALS.FRAM_SPI_CS
FRAM_WP: U9.68(P9.0_S7) ; port FRAM_SIGNALS.FRAM_WP
I2C0_EN: U9.42(P3.0_TA1CLK_CBOUT_S31) ; port I2C0_BUS.ENABLE
I2C0_READY: U9.45(P3.3_TA1.2_S28) ; port I2C0_BUS.READY
I2C0_SCL: U9.19(P2.2_P2MAP2) ; port I2C0_BUS.I2C0_SCL
I2C0_SDA: U9.18(P2.1_P2MAP1) ; port I2C0_BUS.I2C0_SDA
I2C1_EN: U9.43(P3.1_TA1.0_S30) ; port I2C1_BUS.ENABLE
I2C1_READY: U9.46(P3.4_TA2CLK_SMCLK_S27) ; port I2C1_BUS.READY
I2C1_SCL: U9.66(P8.6_UCB1SOMI_UCB1SCL_S9) ; port I2C1_BUS.I2C1_SCL
I2C1_SDA: U9.65(P8.5_UCB1SIMO_UCB1SDA_S10) ; port I2C1_BUS.I2C1_SDA
I2C2_EN: U9.44(P3.2_TA1.1_S29) ; port I2C2_BUS.ENABLE
I2C2_READY: U9.47(P3.5_TA2.0_S26) ; port I2C2_BUS.READY
I2C2_SCL: U9.74(P9.6_UCB2SOMI_UCB2SCL_S1) ; port I2C2_BUS.I2C2_SCL
I2C2_SDA: U9.73(P9.5_UCB2SIMO_UCB2SDA_S2) ; port I2C2_BUS.I2C2_SDA
JTAG_TCK: TP1.1 U9.91(TEST_SBWTCK) ; port JTAG.TCK
JTAG_TDO_TDI: C1.1 R1.1 TP2.1 U9.96(RST_NMI_SBWTDIO_N) ; port JTAG.TDO, port WATCHDOG_SIGNALS.RESET_WDOG
MAIN_RADIO_ENABLE: TP32.1 U9.34(P1.0_TA0CLK_ACLK_S39) ; port TTC_SIGNALS.MAIN_RADIO_ENABLE
MAIN_RADIO_GPIO0: TP28.1 U9.35(P1.1_TA0.0_S38) ; port TTC_SIGNALS.MAIN_RADIO_GPIO0
MAIN_RADIO_GPIO1: TP29.1 U9.36(P1.2_TA0.1_S37) ; port TTC_SIGNALS.MAIN_RADIO_GPIO1
MAIN_RADIO_GPIO2: TP30.1 U9.37(P1.3_TA0.2_S36) ; port TTC_SIGNALS.MAIN_RADIO_GPIO2
MAIN_RADIO_RESET: TP31.1 U9.38(P1.4_TA0.3_S35) ; port TTC_SIGNALS.MAIN_RADIO_RESET
MAIN_RADIO_SPI_CS: TP33.1 U9.39(P1.5_TA0.4_S34) ; port TTC_SIGNALS.MAIN_RADIO_SPI_CS
MEM_HOLD: U9.52(P4.2_TB0.2_S21) ; port MEMORY_SIGNALS.MEM_HOLD
MEM_RESET: U9.53(P4.3_TB0.3_S20) ; port MEMORY_SIGNALS.MEM_RESET
MEM_SPI_CS: U9.54(P4.4_TB0.4_S19) ; port MEMORY_SIGNALS.MEM_SPI_CS
OBDH_CURRENT_ADC: TP6.1 U9.100(P6.3_CB3_A3) ; port ADC_READINGS.OBDH_CURRENT_ADC
OBDH_VOLTAGE_ADC: TP7.1 U9.1(P6.4_CB4_A4) ; port ADC_READINGS.OBDH_VOLTAGE_ADC
PAYLOAD_0_ENABLE: TP41.1 U9.32(P5.4_COM2_S41) ; port PAYLOAD_0_ENABLE
PAYLOAD_1_ENABLE: TP40.1 U9.33(P5.5_COM3_S40) ; port PAYLOAD_1_ENABLE
PC104_GPIO0: U9.48(P3.6_TA2.1_S25) ; port PC104_GPIOs.PC104_GPIO0
PC104_GPIO1: U9.49(P3.7_TA2.2_S24) ; port PC104_GPIOs.PC104_GPIO1
PC104_GPIO2: U9.50(P4.0_TB0.0_S23) ; port PC104_GPIOs.PC104_GPIO2
PC104_GPIO3: U9.51(P4.1_TB0.1_S22) ; port PC104_GPIOs.PC104_GPIO3
PC104_GPIO4: U9.55(P4.5_TB0.5_S18) ; port PC104_GPIOs.PC104_GPIO4
PC104_GPIO5: U9.56(P4.6_TB0.6_S17) ; port PC104_GPIOs.PC104_GPIO5
PC104_GPIO6: U9.57(P4.7_TB0OUTH_SVMOUT_S16) ; port PC104_GPIOs.PC104_GPIO6
SPI_CLK: TP5.1 U9.17(P2.0_P2MAP0) ; port SPI_BUS.SPI_CLK
SPI_MISO: TP4.1 U9.22(P2.5_P2MAP5) ; port SPI_BUS.SPI_MISO
SPI_MOSI: TP3.1 U9.21(P2.4_P2MAP4) ; port SPI_BUS.SPI_MOSI
SYSTEM_FAULT_LED: R3.2 U9.28(P5.2_R23)
SYSTEM_LED: R2.2 U9.31(P5.3_COM1_S42)
TTC_MCU_SPI_CS: TP34.1 U9.40(P1.6_TA0.1_S33) ; port TTC_SIGNALS.TTC_MCU_SPI_CS
UART0_RX: R5.2 U9.71(P9.3_UCA2RXD_UCA2SOMI_S4) ; port UART0_BUS.Rx
UART0_TX: R4.2 U9.70(P9.2_UCA2TXD_UCA2SIMO_S5) ; port UART0_BUS.Tx
UART1_RX: R7.2 U9.61(P8.3_UCA1RXD_UCA1SOMI_S12) ; port UART1_BUS.Rx
UART1_TX: R6.2 U9.60(P8.2_UCA1TXD_UCA1SIMO_S13) ; port UART1_BUS.Tx
VERSION_BIT0: U9.23(P2.6_P2MAP6_R03) V1.1 V2.2
VERSION_BIT1: U9.24(P2.7_P2MAP7_LCDREF_R13) V3.1 V4.2
VREF: U9.9(P5.0_VREF+_VeREF+) ; port VREF
WDI_EXT: TP9.1 U9.72(P9.4_UCB2CLK_UCA2STE_S3) ; port WATCHDOG_SIGNALS.WDI_EXT
XT1IN: C5.2 U9.13(XIN) Y2.1
XT1OUT: C6.2 U9.14(XOUT) Y2.2
XT2_N: C3.1 U9.84(P7.2_XT2IN) Y1.1
XT2_P: C4.1 U9.85(P7.3_XT2OUT) Y1.3
NetC2_2: C2.2 U9.27(VCORE)
NetD1_1: D1.1(A) R2.1
NetD2_1: D2.1(A) R3.1
NetD3_1: D3.1(A) R4.1
NetD4_1: D4.1(A) R5.1
NetD5_1: D5.1(A) R6.1
NetD6_1: D6.1(A) R7.1
NetTP10_1: TP10.1 U9.88(P5.7_RTCCLK)
NetTP21_1: TP21.1 U9.92(PJ.0_TDO)
NetTP22_1: TP22.1 U9.93(PJ.1_TDI_TCLK)
NetTP23_1: TP23.1 U9.94(PJ.2_TMS)
NetTP24_1: TP24.1 U9.95(PJ.3_TCK)

Not connected (* = marked no-connect by the designer): U9 4(P6.7_CB7_A7_DAC1) 16(P5.6_ADC12CLK_DMAE0) 20(P2.3_P2MAP3) 29(LCDCAP_R33) 30(COM0) 41(P1.7_TA0.2_S32) 58(P8.0_TB0CLK_S15) 59(P8.1_UCB1STE_UCA1CLK_S14) 62(P8.4_UCB1CLK_UCA1STE_S11) 76(VSSU) 77(PU.0_DP) 78(PUR) 79(PU.1_DM) 80(VBUS) 81(VUSB) 82(V18) 86(VBAK) 87(VBAT)

### Layout directives
differential pair: XT2_N, XT2_P

### Notes on the sheet
- From JTAG Header
- To Communication Buffers
- To Debug Header
- To PC104 (Main Radio and TTC)
- From Analog Circuits
- From Watchdog
- To PC104
- From PC104
- To Daughter Board
- From FRAM memory
- From NOR flash memory
- (near R1) JTAG AND VERSIONING COMPONENTS
- (near R2) DNP
- (near D1) DNP
- (near R3) DNP
- (near D2) DNP
- (near V1) DNP
- (near R4) DNP
- (near D3) DNP
- (near V4) DNP
- (near R5) DNP
- (near D4) DNP
- Configuration for version v0.7
- (near R6) DNP
- (near D5) DNP
- Communication Assigment and Configuration:
  - USCI_A0 - SPI: (Memory, Main Radio, TTC and Daughter board)
  Chip Selects:1 Memory, 1 Main radio, 1 TTC and 2 Daugther board
  Config: Length - 8bits, Phase - High, Polarity - Low, Endianness - MSB, Data Rate - 400kbps
  - USCI_A1 - UART1: (Transceiver RS485)
  Config: Baundrate - 115200, Data Bits - 8 bits, Parity - None, Stop Bits - 1
  - USCI_A2 - UART0: (Debug)
  Config: Baundrate - 115200, Data Bits - 8 bits, Parity - None, Stop Bits - 1
  - USCI_B0 - I2C0: (Buffer I2C)
  Config: Master, Slave Address Length - 7 bits, Data Rate - 100kbps
  - USCI_B1 - I2C1: (Buffer I2C)
  Config: Master, Slave Address Length - 7 bits, Data Rate - 100kbps
  - USCI_B2 - I2C2: (Buffer I2C)(Antenna and Daughter Board)
  Config: Master, Slave Address Length - 7 bits, Data Rate - 100kbps
  All USCIs uses the SMCLK as clock source
- (near R7) DNP
- (near D6) DNP
- LTST-C170KFKT
- Daughter Board Interface:
  - Power Supply:
  OBDH_DVCC (3V3), ANTENNA_VCC (3V3), BATTERY_VCC(5V4-8V4)
  - Inputs/Outputs:
  GPIO0(GPIO/ADC), GPIO1(GPIO/ADC), GPIO2(GPIO/ADC/DAC), GPIO3(GPIO/ADC/DAC)
  ADC0(ADC/GPIO), ADC1(ADC/GPIO), ADC2(ADC/GPIO)
  - Communication:
  SPI (2 chip selects avaliable) and I2C (shared with antenna)
- Clock Configuration:
  MCLK: (Master Clock) - 32MHz
  MCLK is used by the CPU.
  SMCLK: (Subsystem Master Clock) - 32MHz
  SMCLK is used by the peripheral modules.
  ACLK: (Auxiliary Clock) - 32.768kHz
  ACLK  used in low power modes. Also, it is a software selectable by individual peripheral modules.
- LEDs Assigment:
  - SYSTEM LED (D1): (P5.3) Watchdog reset (blink each second)
  - SYSTEM FAULT(D2): (P5.2) Active in case of hardware check routine failure
  - UART DEBUG (D3, D4, D5, D6): UART TX and RX operation checks
- Project:
- SpaceLab - Federal University of Santa Catarina
- Title:
- Engineer:
- Project Code:
- Date:
- Revision:
- Sheet
- of
- Size:
- A3
- (in symbol Cap_Cer_X7R_0.47uF_50V_0805) .
- (in symbol Cap_Cer_X7R_10pF_100V_0805) .
- (in symbol Cap_Cer_X7R_12pF_50V_0805) .
- (in symbol Xtal_32.768kHz_12pF_2_SMD) .
- (in symbol Cap_Cer_X7R_1nF_16V_0603) .

### Library data of the parts
C1 = Cap_Cer_X7R_1nF_16V_0603: CAP CER 1nF 16V 0603 5%; Partnumber: C0603X102J4RECAUTO; NCM: 8532.24.10
C2 = Cap_Cer_X7R_0.47uF_50V_0805: CAP CER 0.47UF 50V 10% X7R 0805; Partnumber: C0805C474K5RACTU; NCM: 8532.24.10
C3 C4 = Cap_Cer_X7R_10pF_100V_0805: CAP CER 10pF 100V 0805; Partnumber: 08051A100FAT2A; NCM: 8532.24.10
C5 C6 = Cap_Cer_X7R_12pF_50V_0805: CAP CER 12pF 50V 0805; Partnumber: CL21C120FBANNNC; NCM: 8532.24.10
D1-D6 = LED/R_0603: SMD Orange LED; Partnumber: LTST-C170KFKT; NCM: 8541.40.21
R1 V1-V4 = R47k_1%_1/8W_0805: RES 47k OHM 1/8W 1% 0805; Partnumber: RC0805FR-0747KL; NCM: 8533.21.20
R2-R7 = R1.0k_1%_1/8W_0805: RES 1.0K OHM 1/8W 1% 0805; Partnumber: RC0805FR-071KL; NCM: 8533.21.20
TP1-TP10 TP21-TP24 TP28-TP41 = TEST_POINT_2: Test point
U9 = MSP430F6659IPZR_1: Imported; Manufacturer: Texas Instruments; CompType: IC; PIN_COUNT: 100; Application_BuildNumber: *; PartNumber: MSP430F6659IPZR; Alternate PartNumber: MSP430F6659IPZ; PackageReference: PZ0100A; MountType: SMT; RoHS: Y; RefDes: RefDes; Type: DEV; Value: Value
Y1 = XTAL_32MHz_SMD_4-SMD: 32MHz ±10ppm Crystal 10pF 60 Ohm -40°C ~ 125°C; Partnumber: ABM8X-102-32.000MHZ-T; NCM: 8541.60.10
Y2 = Xtal_32.768kHz_12pF_2_SMD: 32.768kHz ±20ppm Crystal 12.5pF 70 kOhm -40°C ~ 125°C; Partnumber: ECS-.327-12.5-34S-TR; NCM: 8541.60.10

## Sheet 4_analog_circuits.schdoc: Analog Circuits
size A4; Engineer: Eng_2_ALT; Revision: v0.7; SheetNumber: 4; SheetTotal: 6; Designed by: André M. P. Mattos; Version: v0.7; ProjectCode: obdh2
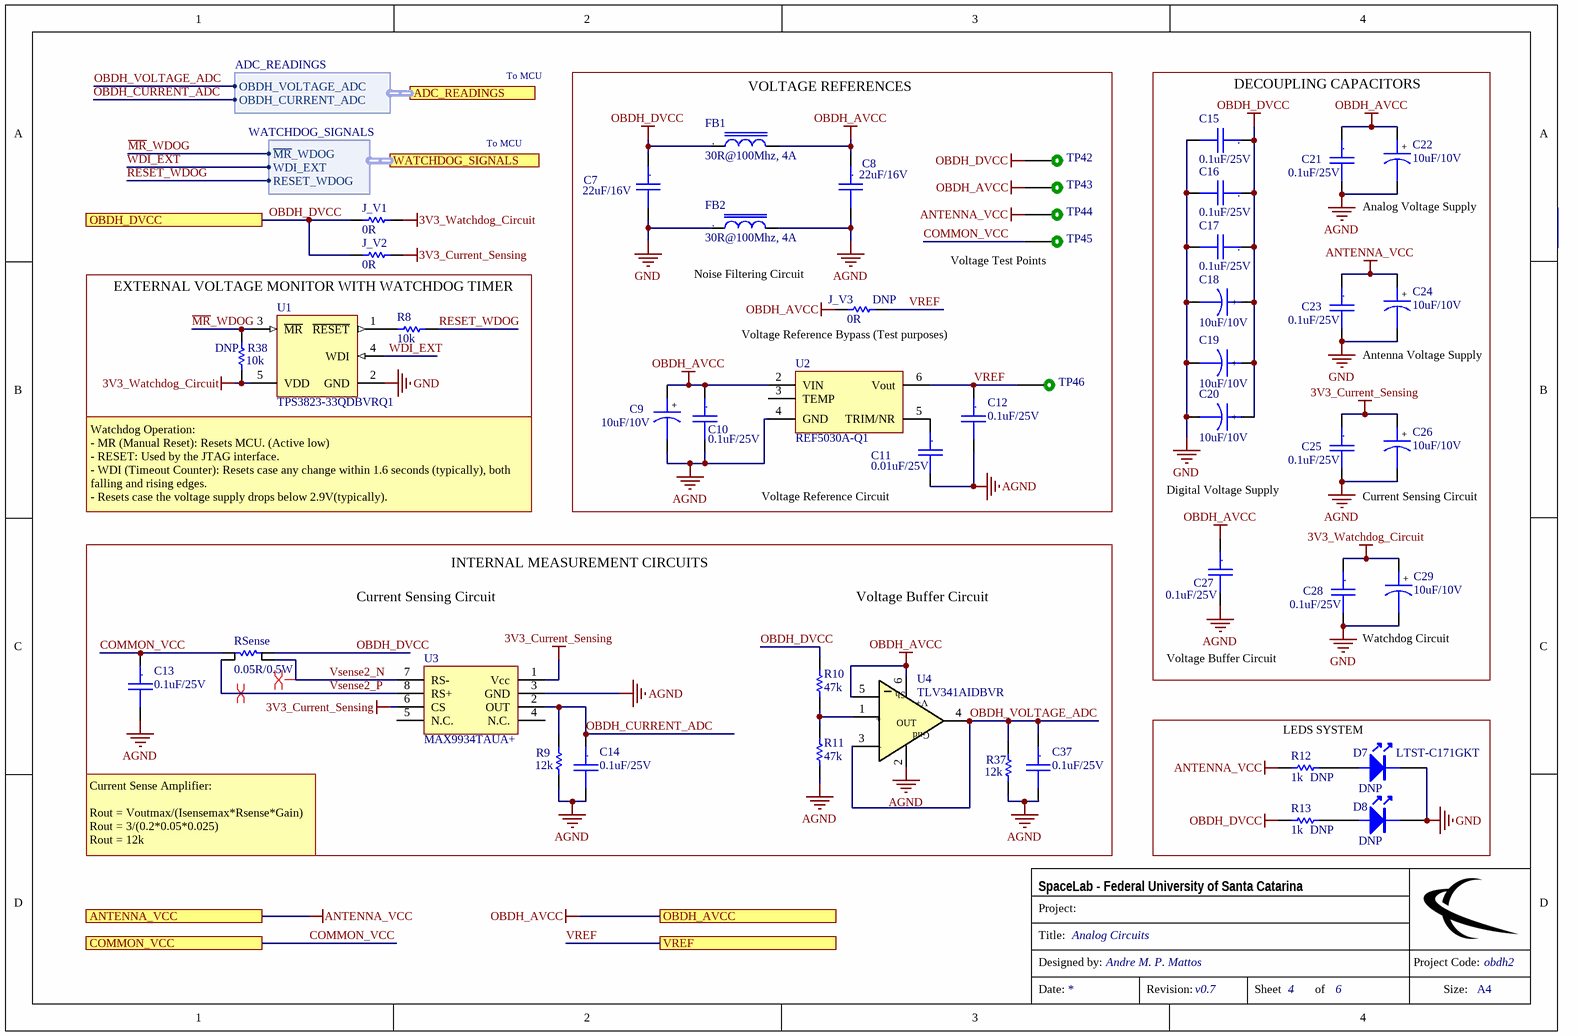
[diagram p4: 4_analog_circuits.schdoc]

### Parts
C7  22uF/16V  [CC1210]
C8  22uF/16V  [CC1210]
C9  10uF/10V  [CC0805_Tantalum]
C10  0.1uF/25V  [CC0805]
C11  0.01uF/25V  [CC0805]
C12  0.1uF/25V  [CC0805]
C13  0.1uF/25V  [CC0805]
C14  0.1uF/25V  [CC0805]
C15  0.1uF/25V  [CC0805]
C16  0.1uF/25V  [CC0805]
C17  0.1uF/25V  [CC0805]
C18  10uF/10V  [CC0805_Tantalum]
C19  10uF/10V  [CC0805_Tantalum]
C20  10uF/10V  [CC0805_Tantalum]
C21  0.1uF/25V  [CC0805]
C22  10uF/10V  [CC0805_Tantalum]
C23  0.1uF/25V  [CC0805]
C24  10uF/10V  [CC0805_Tantalum]
C25  0.1uF/25V  [CC0805]
C26  10uF/10V  [CC0805_Tantalum]
C27  0.1uF/25V  [CC0805]
C28  0.1uF/25V  [CC0805]
C29  10uF/10V  [CC0805_Tantalum]
C37  0.1uF/25V  [CC0805]
D7  DNP  [0805-LED]
D8  DNP  [0805-LED]
FB1  30R@100Mhz, 4A  [IND0805]
FB2  30R@100Mhz, 4A  [IND0805]
J_V1  0R  [0805]
J_V2  0R  [0805]
J_V3  0R  [0805]
R8  10k  [0805]
R9  12k  [0805]
R10  47k  [0805]
R11  47k  [0805]
R12  1k  [0805]
R13  1k  [0805]
R37  12k  [0805]
R38  10k  [0805]
RSense  0.05R/0.5W  [1206 - ohmite]
TP42  TEST_POINT_2  [TEST_POINT_2]  (value not drawn)  (no BOM)
TP43  TEST_POINT_2  [TEST_POINT_2]  (value not drawn)  (no BOM)
TP44  TEST_POINT_2  [TEST_POINT_2]  (value not drawn)  (no BOM)
TP45  TEST_POINT_2  [TEST_POINT_2]  (value not drawn)  (no BOM)
TP46  TEST_POINT_2  [TEST_POINT_2]  (value not drawn)  (no BOM)
U1  TPS3823-33QDBVRQ1  [DBV0005A_N]
U2  REF5030A-Q1  [SOIC-8]
U3  MAX9934TAUA+  [MSOP-8]
U4  TLV341AIDBVR  [SOT-23 6L]

### Blocks framed on the sheet
VOLTAGE REFERENCES: C7-C12 FB1 FB2 J_V3 TP42-TP46 U2
DECOUPLING CAPACITORS: C15-C29
EXTERNAL VOLTAGE MONITOR WITH WATCHDOG TIMER: R8 R38 U1

### Ports
ADC_READINGS (harness ADC_READINGS), ANTENNA_VCC, COMMON_VCC, OBDH_AVCC, OBDH_DVCC, VREF, WATCHDOG_SIGNALS (harness WATCHDOG_SIGNALS)

### Harnesses
ADC_READINGS: OBDH_VOLTAGE_ADC, OBDH_CURRENT_ADC
WATCHDOG_SIGNALS: ~{MR}_WDOG, WDI_EXT, RESET_WDOG

### Nets
3V3_Current_Sensing: C25.1 C26.1 J_V2.1 U3.1(Vcc) U3.6(CS)
3V3_Watchdog_Circuit: C28.1 C29.1 J_V1.1 R38.1 U1.5(VDD)
AGND: C8.2 C9.2 C10.2 C11.2 C12.2 C13.2 C14.2 C21.2 C22.2 C25.2 C26.2 C27.2 C37.2 FB2.2 R9.1 R11.1 R37.1 U2.4(GND) U3.3(GND) U4.2(Gnd)
ANTENNA_VCC: C23.1 C24.1 R12.2 TP44.1 ; port ANTENNA_VCC
GND: C7.2 C15.2 C16.2 C17.2 C18.2 C19.2 C20.2 C23.2 C24.2 C28.2 C29.2 D7.2(K) D8.2(K) FB2.1 U1.2(GND)
OBDH_AVCC: C8.1 C9.1 C10.1 C21.1 C22.1 C27.1 FB1.2 J_V3.2 TP43.1 U2.2(VIN) U4.5(EN) U4.6(V+) ; port OBDH_AVCC
OBDH_DVCC: C7.1 C15.1 C16.1 C17.1 C18.1 C19.1 C20.1 FB1.1 J_V1.2 J_V2.2 R10.2 R13.2 RSense.2 TP42.1 ; port OBDH_DVCC
~{MR}_WDOG: R38.2 U1.3(~{MR}) ; port WATCHDOG_SIGNALS.~{MR}_WDOG
COMMON_VCC: C13.1 RSense.1 TP45.1 ; port COMMON_VCC
OBDH_CURRENT_ADC: C14.1 R9.2 U3.2(OUT) ; port ADC_READINGS.OBDH_CURRENT_ADC
OBDH_VOLTAGE_ADC: C37.1 R37.2 U4.3(-IN) U4.4(OUT) ; port ADC_READINGS.OBDH_VOLTAGE_ADC
RESET_WDOG: R8.2 ; port WATCHDOG_SIGNALS.RESET_WDOG  [project net JTAG_TDO_TDI]
VREF: C12.1 J_V3.1 TP46.1 U2.6(Vout) ; port VREF
Vsense2_N: RSense.4 U3.7(RS-)
Vsense2_P: RSense.3 U3.8(RS+)
WDI_EXT: U1.4(WDI) ; port WATCHDOG_SIGNALS.WDI_EXT
NetC11_1: C11.1 U2.5(TRIM/NR)
NetD7_1: D7.1(A) R12.1
NetD8_1: D8.1(A) R13.1
NetR8_1: R8.1 U1.1(~{RESET})
NetR10_1: R10.1 R11.2 U4.1(+IN)

Not connected (* = marked no-connect by the designer): U2 3(TEMP); U3 4(N.C.) 5(N.C.)

### Layout directives
differential pair: Vsense2_N, Vsense2_P

### Notes on the sheet
- To MCU
- Analog Voltage Supply
- Noise Filtering Circuit
- (near J_V3) DNP
- (near TP45) Voltage Test Points
- (near R38) DNP
- (near J_V3) Voltage Reference Bypass (Test purposes)
- Antenna Voltage Supply
- Watchdog Operation:
  - MR (Manual Reset): Resets MCU. (Active low)
  - RESET: Used by the JTAG interface.
  - WDI (Timeout Counter): Resets case any change within 1.6 seconds (typically), both falling and rising edges.
  - Resets case the voltage supply drops below 2.9V(typically).
- (near C11) Voltage Reference Circuit
- Digital Voltage Supply
- Current Sensing Circuit
- INTERNAL MEASUREMENT CIRCUITS
- Voltage Buffer Circuit
- Watchdog Circuit
- LEDS SYSTEM
- (near R12) DNP
- (near D7) LTST-C171GKT
- Current Sense Amplifier:
  Rout = Voutmax/(Isensemax*Rsense*Gain)
  Rout = 3/(0.2*0.05*0.025)
  Rout = 12k
- (near R13) DNP
- Project:
- SpaceLab - Federal University of Santa Catarina
- Title:
- Designed by:
- Project Code:
- Date:
- Revision:
- Sheet
- of
- Size:
- A4
- (in symbol Cap_Cer_X7R_0.01uF_16V_1210) .
- (in symbol Cap_Cer_X7R_0.1uF_25V_0805) .
- (in symbol Cap_Cer_X7R_0.01uF_50V_0805) .
- (in symbol Cap_Tant_SMD_10uF_6V3_0805) +
- (in symbol Cap_Tant_SMD_10uF_10V_0805) +
- (in symbol FB_30R_4A_100MHz_0805) .
- (in symbol TLV341AIDBVR) Sh; +; -

### Library data of the parts
C7 C8 = Cap_Cer_X7R_0.01uF_16V_1210: CAP CER 22uF 16V 10% X7R 1210; Partnumber: C3225X7R1C226K250AC; NCM: 8532.24.10
C9 C18-C20 = Cap_Tant_SMD_10uF_6V3_0805: CAP Tantalum 10uF 6.3V 10% 0805; Partnumber: TPSR106K006R1000; NCM: 8532.21.11
C10 C12-C17 C21 C23 C25 C27 C28 C37 = Cap_Cer_X7R_0.1uF_25V_0805: CAP CER 0.1UF 25V 10% X7R 0805; Partnumber: CC0805KRX7R8BB104; NCM: 8532.24.10
C11 = Cap_Cer_X7R_0.01uF_50V_0805: CAP CER 0.01uF 25V 10% X7R 0805; Partnumber: CL21B103KAANNNC; NCM: 8532.24.10
C22 C24 C26 C29 = Cap_Tant_SMD_10uF_10V_0805: CAP Tantalum 10uF 10V 20% 0805; Partnumber: TPSP106M010R2000; NCM: 8532.21.11
D7 D8 = LED/G_0805: SMD Green LED; Partnumber: LTST-C171GKT; NCM: 8541.40.21
FB1 FB2 = FB_30R_4A_100MHz_0805: Ferrite Bead 30 OHM 4A 100MHz; Partnumber: BLM21PG300SN1D; NCM: 8504.50.00
J_V1-J_V3 = R0R_JUMPER_1/8W_0805: RES 0R OHM 1/8W JUMPER 0805; Partnumber: CRCW08050000Z0EA; NCM: 8533.21.20
R8 R38 = R10k_1%_1/8W_0805: RES 10K OHM 1/8W 1%  0805; Partnumber: CRCW080510K0FKEA; NCM: 8533.21.20
R9 R37 = R12k_1%_1/8W_0805: RES 12K OHM 1/8W 1%  0805; Partnumber: RC0805FR-0712KL; NCM: 8533.21.20
R10 R11 = R47k_1%_1/8W_0805: as R1 on sheet 3_mcu_main; NCM: 8533.21.20
R12 R13 = R1.0k_1%_1/8W_0805: as R2 on sheet 3_mcu_main; NCM: 8533.21.20
RSense = R0.05R_0.5%_0.5W_1206: Current Sense Resistors - SMD 0.05ohm .5% 4 Terminal; Partnumber: LVK12R050DER; NCM: 8533.21.20
TP42-TP46 = TEST_POINT_2: Test point
U1 = CMP-0338-00011-2: Processor Supervisory Circuit, 1 Supply Monitored, -40 to 85 degC, 5-Pin SOT-23 (DBV), Green (RoHS & no Sb/Br); Manufacturer: Texas Instruments; Iq: 15 uA Typ.; Threshold Voltage: 2.93 V Typ.; Watchdog Timer WDI: 0.2 s; VCC: 1.1 V Min.; Reset Threshold Accuracy: 2.4%; Rating: Catalog; Time Delay: 25 ms; # of Supplies Monitored: 1; Output Driver Type / Reset Output: Active-low, Push-pull; Packing: Tape and Reel; ComponentLink1Description: Manufacturer URL; RoHS: TRUE; PackageDescription: 5-Pin Plastic Small Outline, Body 1.6 x 2.9 mm, Pitch 0.95 mm; Mounting Technology: Surface Mount; ComponentLink1URL: www.ti.com; PackageReference: DBV0005A; ComponentLink3URL: http://www.ti.com/lit/ml/mpds018j/mpds018j.pdf; ComponentLink3Description: Package Specification; PartNumber: TPS3823-33QDBVRQ1; DatasheetVersion: SLVS165J; ComponentLink2Description: Datasheet; PackageVersion: 4073253-4/L; ComponentLink2URL: http://www.ti.com/lit/ds/symlink/tps3820-33.pdf; Operating Temperature Range: -40 to 85 degC
U2 = REF5030A-Q1: Partnumber: REF5030A-Q1
U3 = MAX9934TAUA+: Partnumber: MAX9934TAUA+
U4 = TLV341AIDBVR: Partnumber: TLV341AIDBVR

## Sheet 5_non_volatile_memory.schdoc: Non Volatile Memory
size A4; Engineer: Eng_2_ALT; Revision: v0.7; SheetNumber: 5; SheetTotal: 6; Designed by: André M. P. Mattos; Version: v0.7; ProjectCode: obdh2
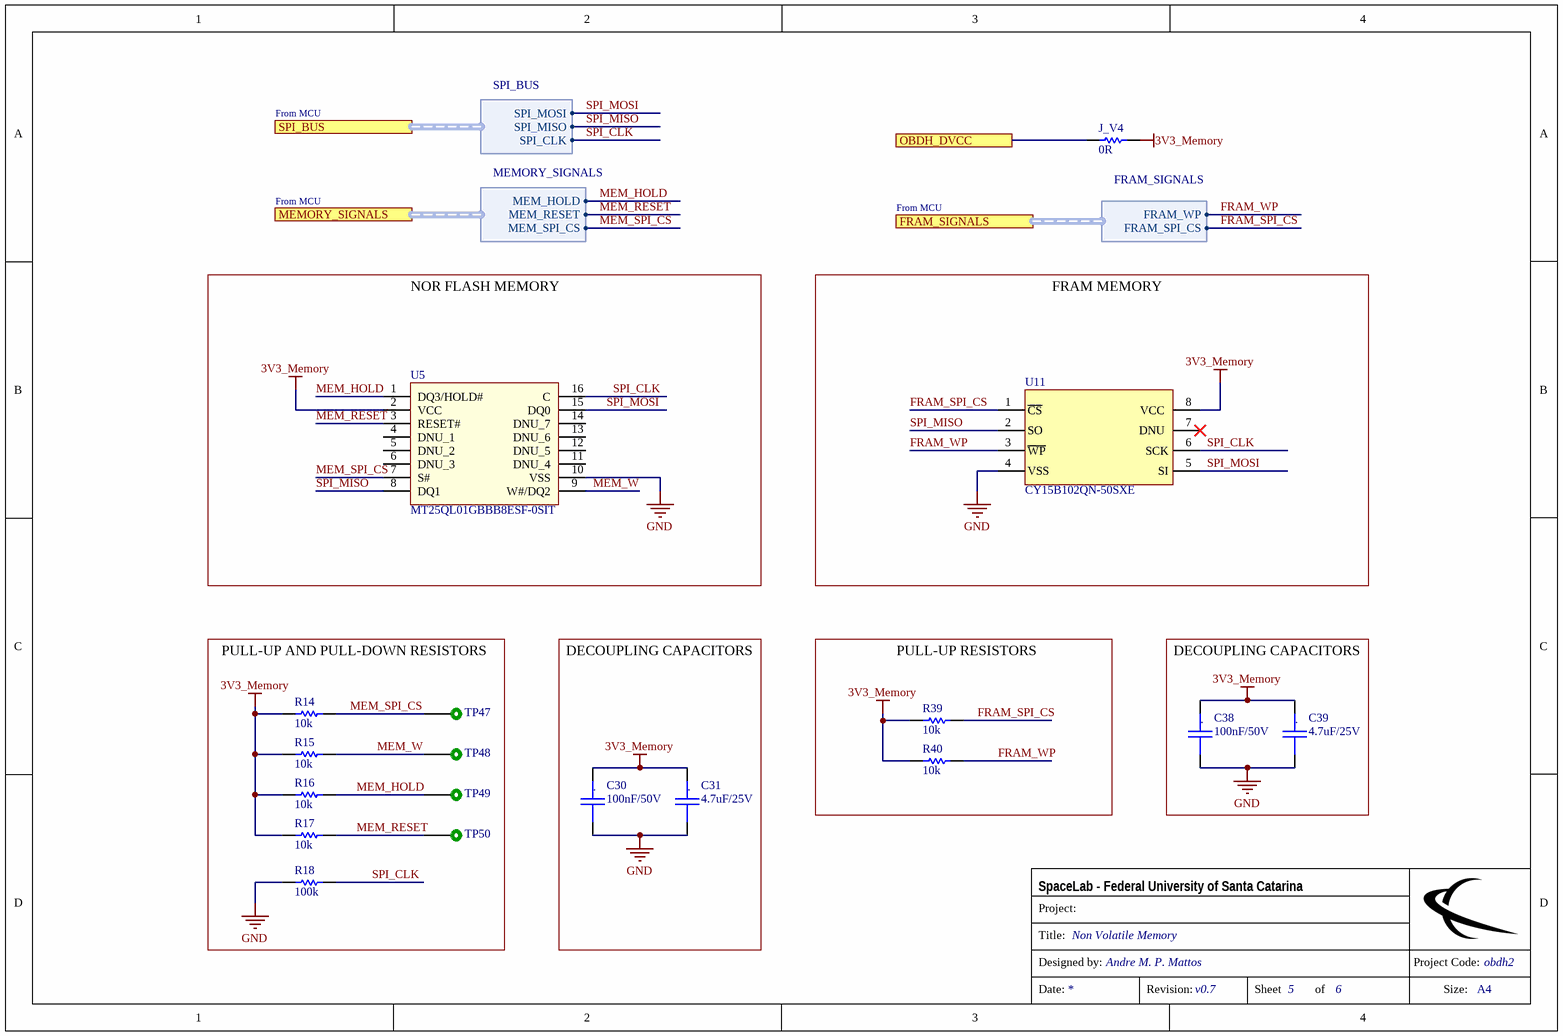
[diagram p5: 5_non_volatile_memory.schdoc]

### Parts
C30  100nF/50V  [CC0805]
C31  4.7uF/25V  [CC0805]
C38  100nF/50V  [CC0805]
C39  4.7uF/25V  [CC0805]
J_V4  0R  [0805]
R14  10k  [0805]
R15  10k  [0805]
R16  10k  [0805]
R17  10k  [0805]
R18  100k  [0805]
R39  10k  [0805]
R40  10k  [0805]
TP47  TEST_POINT_2  [TEST_POINT_2]  (value not drawn)  (no BOM)
TP48  TEST_POINT_2  [TEST_POINT_2]  (value not drawn)  (no BOM)
TP49  TEST_POINT_2  [TEST_POINT_2]  (value not drawn)  (no BOM)
TP50  TEST_POINT_2  [TEST_POINT_2]  (value not drawn)  (no BOM)
U5  MT25QL01GBBB8ESF-0SIT  [SOIC127P1032X265-16N]
U11  CY15B102QN-50SXE  [SOIC8]

### Blocks framed on the sheet
NOR FLASH MEMORY: U5
FRAM MEMORY: U11
PULL-UP AND PULL-DOWN RESISTORS: R14-R18 TP47-TP50
DECOUPLING CAPACITORS: C30 C31
PULL-UP RESISTORS: R39 R40
DECOUPLING CAPACITORS: C38 C39

### Ports
FRAM_SIGNALS (harness FRAM_SIGNALS), MEMORY_SIGNALS (harness MEMORY_SIGNALS), OBDH_DVCC, SPI_BUS (harness SPI_BUS)

### Harnesses
SPI_BUS: SPI_CLK, SPI_MISO, SPI_MOSI
MEMORY_SIGNALS: MEM_SPI_CS, MEM_RESET, MEM_HOLD
FRAM_SIGNALS: FRAM_SPI_CS, FRAM_WP

### Nets
3V3_Memory: C30.1 C31.1 C38.1 C39.1 J_V4.1 R14.2 R15.2 R16.2 R17.2 R39.2 R40.2 U5.2(VCC) U11.8(VCC)
GND: C30.2 C31.2 C38.2 C39.2 R18.2 U5.10(VSS) U11.4(VSS)
OBDH_DVCC: J_V4.2 ; port OBDH_DVCC
FRAM_SPI_CS: R39.1 U11.1(~{CS}) ; port FRAM_SIGNALS.FRAM_SPI_CS
FRAM_WP: R40.1 U11.3(~{WP}) ; port FRAM_SIGNALS.FRAM_WP
MEM_HOLD: R16.1 TP49.1 U5.1(DQ3/HOLD#) ; port MEMORY_SIGNALS.MEM_HOLD
MEM_RESET: R17.1 TP50.1 U5.3(RESET#) ; port MEMORY_SIGNALS.MEM_RESET
MEM_SPI_CS: R14.1 TP47.1 U5.7(S#) ; port MEMORY_SIGNALS.MEM_SPI_CS
MEM_W: R15.1 TP48.1 U5.9(W#/DQ2)
SPI_CLK: R18.1 U5.16(C) U11.6(SCK) ; port SPI_BUS.SPI_CLK
SPI_MISO: U5.8(DQ1) U11.2(SO) ; port SPI_BUS.SPI_MISO
SPI_MOSI: U5.15(DQ0) U11.5(SI) ; port SPI_BUS.SPI_MOSI

Not connected (* = marked no-connect by the designer): U5 4(DNU_1) 5(DNU_2) 6(DNU_3) 11(DNU_4) 12(DNU_5) 13(DNU_6) 14(DNU_7); U11 7(DNU)*

### Notes on the sheet
- From MCU
- Project:
- SpaceLab - Federal University of Santa Catarina
- Title:
- Designed by:
- Project Code:
- Date:
- Revision:
- Sheet
- of
- Size:
- A4
- (in symbol Cap_Cer_X7R_4.7uF_25V_0805) .
- (in symbol Cap_Cer_X7R_100nF_50V_0603) .

### Library data of the parts
C30 C38 = Cap_Cer_X7R_100nF_50V_0603: CAP CER 100nF 50V 0603 10%; Partnumber: C0603C104K5RAC3121; NCM: 8532.24.10
C31 C39 = Cap_Cer_X7R_4.7uF_25V_0805: CAP CER 4.7UF 25V 10% X7R 0805; Partnumber: C0805C475K3RACAUTO; NCM: 8532.24.10
J_V4 = R0R_JUMPER_1/8W_0805: as J_V1 on sheet 4_analog_circuits; NCM: 8533.21.20
R14-R17 R39 R40 = R10k_1%_1/8W_0805: as R8 on sheet 4_analog_circuits; NCM: 8533.21.20
R18 = R100k_1%_1/8W_0805: RES 100K OHM 1/8W 1% 0805; Partnumber: AC0805FR-13100KL; NCM: 8533.21.20
TP47-TP50 = TEST_POINT_2: Test point
U5 = MT25QL01GBBB8ESF-0SIT: IC FLASH 1GBIT 108MHZ 16SOIC; Manufacturer_Name: Micron; Geometry.Height: 2.65mm; Partnumber: MT25QL01GBBB8ESF-0SIT; Mouser Part Number: 340-278808-TRAY; Mouser Price/Stock: https://www.mouser.com/Search/Refine.aspx?Keyword=340-278808-TRAY; RS Part Number: *; RS Price/Stock: *; Datasheet Link: https://www.micron.com/~/media/documents/products/data-sheet/nor-flash/serial-nor/mt25q/die-rev-b/mt25q_qlkt_l_01g_bbb_0.pdf
U11 = CY15B102QN-50SXE: FRAM (Ferroelectric RAM) Memory IC 2Mb (256K x 8) SPI 50 MHz 8-SOIC; Partnumber: CY15B102QN-50SXE

## Sheet 6_communication_buffers.schdoc: Communication Buffers
size A4; Engineer: Eng_2_ALT; SheetNumber: 6; SheetTotal: 6; Designed by: André M. P. Mattos; Version: v0.5
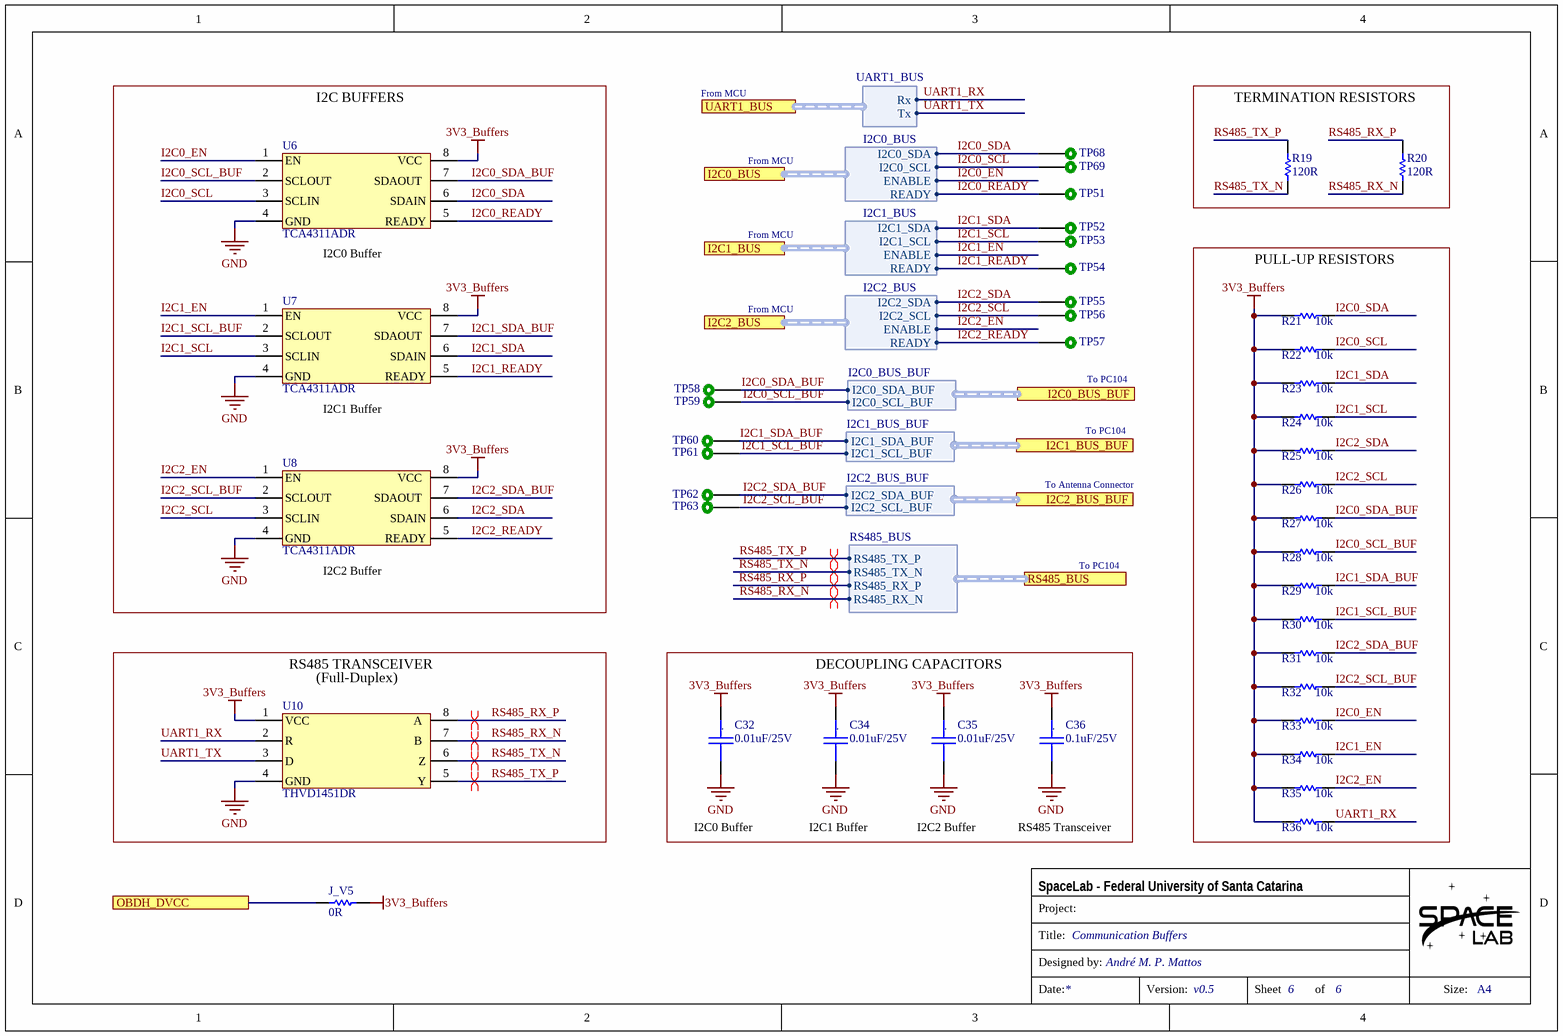
[diagram p6: 6_communication_buffers.schdoc]

### Parts
C32  0.01uF/25V  [CC0805]
C34  0.01uF/25V  [CC0805]
C35  0.01uF/25V  [CC0805]
C36  0.1uF/25V  [CC0805]
J_V5  0R  [0805]
R19  120R  [0805]
R20  120R  [0805]
R21  10k  [0805]
R22  10k  [0805]
R23  10k  [0805]
R24  10k  [0805]
R25  10k  [0805]
R26  10k  [0805]
R27  10k  [0805]
R28  10k  [0805]
R29  10k  [0805]
R30  10k  [0805]
R31  10k  [0805]
R32  10k  [0805]
R33  10k  [0805]
R34  10k  [0805]
R35  10k  [0805]
R36  10k  [0805]
TP51  TEST_POINT_2  [TEST_POINT_2]  (value not drawn)  (no BOM)
TP52  TEST_POINT_2  [TEST_POINT_2]  (value not drawn)  (no BOM)
TP53  TEST_POINT_2  [TEST_POINT_2]  (value not drawn)  (no BOM)
TP54  TEST_POINT_2  [TEST_POINT_2]  (value not drawn)  (no BOM)
TP55  TEST_POINT_2  [TEST_POINT_2]  (value not drawn)  (no BOM)
TP56  TEST_POINT_2  [TEST_POINT_2]  (value not drawn)  (no BOM)
TP57  TEST_POINT_2  [TEST_POINT_2]  (value not drawn)  (no BOM)
TP58  TEST_POINT_2  [TEST_POINT_2]  (value not drawn)  (no BOM)
TP59  TEST_POINT_2  [TEST_POINT_2]  (value not drawn)  (no BOM)
TP60  TEST_POINT_2  [TEST_POINT_2]  (value not drawn)  (no BOM)
TP61  TEST_POINT_2  [TEST_POINT_2]  (value not drawn)  (no BOM)
TP62  TEST_POINT_2  [TEST_POINT_2]  (value not drawn)  (no BOM)
TP63  TEST_POINT_2  [TEST_POINT_2]  (value not drawn)  (no BOM)
TP68  TEST_POINT_2  [TEST_POINT_2]  (value not drawn)  (no BOM)
TP69  TEST_POINT_2  [TEST_POINT_2]  (value not drawn)  (no BOM)
U6  TCA4311ADR  [SOIC8]
U7  TCA4311ADR  [SOIC8]
U8  TCA4311ADR  [SOIC8]
U10  THVD1451DR  [SOIC8]

### Blocks framed on the sheet
I2C BUFFERS: U6-U8
TERMINATION RESISTORS: R19 R20
PULL-UP RESISTORS: R21-R36
DECOUPLING CAPACITORS: C32 C34-C36

### Ports
I2C0_BUS (harness I2C0_BUS), I2C0_BUS_BUF (harness I2C0_BUS_BUF), I2C1_BUS (harness I2C1_BUS), I2C1_BUS_BUF (harness I2C1_BUS_BUF), I2C2_BUS (harness I2C2_BUS), I2C2_BUS_BUF (harness I2C2_BUS_BUF), OBDH_DVCC, RS485_BUS (harness RS485_BUS), UART1_BUS (harness UART1_BUS)

### Harnesses
I2C0_BUS_BUF: I2C0_SDA_BUF, I2C0_SCL_BUF
I2C2_BUS_BUF: I2C2_SDA_BUF, I2C2_SCL_BUF
I2C1_BUS_BUF: I2C1_SDA_BUF, I2C1_SCL_BUF
RS485_BUS: RS485_TX_P, RS485_TX_N, RS485_RX_P, RS485_RX_N
I2C0_BUS: I2C0_SCL, I2C0_SDA, ENABLE, READY
UART1_BUS: Rx, Tx
I2C1_BUS: I2C1_SCL, I2C1_SDA, ENABLE, READY
I2C2_BUS: I2C2_SCL, I2C2_SDA, ENABLE, READY

### Nets
3V3_Buffers: C32.1 C34.1 C35.1 C36.1 J_V5.1 R21.2 R22.2 R23.2 R24.2 R25.2 R26.2 R27.2 R28.2 R29.2 R30.2 R31.2 R32.2 R33.2 R34.2 R35.2 R36.2 U6.8(VCC) U7.8(VCC) U8.8(VCC) U10.1(VCC)
GND: C32.2 C34.2 C35.2 C36.2 U6.4(GND) U7.4(GND) U8.4(GND) U10.4(GND)
OBDH_DVCC: J_V5.2 ; port OBDH_DVCC
I2C0_EN: R33.1 U6.1(EN) ; port I2C0_BUS.ENABLE
I2C0_READY: TP51.1 U6.5(READY) ; port I2C0_BUS.READY
I2C0_SCL: R22.1 TP69.1 U6.3(SCLIN) ; port I2C0_BUS.I2C0_SCL
I2C0_SCL_BUF: R28.1 TP59.1 U6.2(SCLOUT) ; port I2C0_BUS_BUF.I2C0_SCL_BUF
I2C0_SDA: R21.1 TP68.1 U6.6(SDAIN) ; port I2C0_BUS.I2C0_SDA
I2C0_SDA_BUF: R27.1 TP58.1 U6.7(SDAOUT) ; port I2C0_BUS_BUF.I2C0_SDA_BUF
I2C1_EN: R34.1 U7.1(EN) ; port I2C1_BUS.ENABLE
I2C1_READY: TP54.1 U7.5(READY) ; port I2C1_BUS.READY
I2C1_SCL: R24.1 TP53.1 U7.3(SCLIN) ; port I2C1_BUS.I2C1_SCL
I2C1_SCL_BUF: R30.1 TP61.1 U7.2(SCLOUT) ; port I2C1_BUS_BUF.I2C1_SCL_BUF
I2C1_SDA: R23.1 TP52.1 U7.6(SDAIN) ; port I2C1_BUS.I2C1_SDA
I2C1_SDA_BUF: R29.1 TP60.1 U7.7(SDAOUT) ; port I2C1_BUS_BUF.I2C1_SDA_BUF
I2C2_EN: R35.1 U8.1(EN) ; port I2C2_BUS.ENABLE
I2C2_READY: TP57.1 U8.5(READY) ; port I2C2_BUS.READY
I2C2_SCL: R26.1 TP56.1 U8.3(SCLIN) ; port I2C2_BUS.I2C2_SCL
I2C2_SCL_BUF: R32.1 TP63.1 U8.2(SCLOUT) ; port I2C2_BUS_BUF.I2C2_SCL_BUF
I2C2_SDA: R25.1 TP55.1 U8.6(SDAIN) ; port I2C2_BUS.I2C2_SDA
I2C2_SDA_BUF: R31.1 TP62.1 U8.7(SDAOUT) ; port I2C2_BUS_BUF.I2C2_SDA_BUF
RS485_RX_N: R20.2 U10.7(B) ; port RS485_BUS.RS485_RX_N
RS485_RX_P: R20.1 U10.8(A) ; port RS485_BUS.RS485_RX_P
RS485_TX_N: R19.2 U10.6(Z) ; port RS485_BUS.RS485_TX_N
RS485_TX_P: R19.1 U10.5(Y) ; port RS485_BUS.RS485_TX_P
UART1_RX: R36.1 U10.2(R) ; port UART1_BUS.Rx
UART1_TX: U10.3(D) ; port UART1_BUS.Tx

### Layout directives
differential pair: RS485_RX_N, RS485_RX_P, RS485_TX_N, RS485_TX_P

### Notes on the sheet
- From MCU
- (near U6) I2C0 Buffer
- (near TP57) To PC104
- (near U7) I2C1 Buffer
- To PC104
- To Antenna Connector
- (near U8) I2C2 Buffer
- (near U10) RS485 TRANSCEIVER
- (near U10) (Full-Duplex)
- I2C0 Buffer
- I2C1 Buffer
- I2C2 Buffer
- RS485 Transceiver
- Project:
- SpaceLab - Federal University of Santa Catarina
- Title:
- Designed by:
- Date:
- Version:
- Sheet
- of
- Size:
- A4
- (in symbol Cap_Cer_X7R_0.1uF_25V_0805) .
- (in symbol Cap_Cer_X7R_0.01uF_50V_0805) .

### Library data of the parts
C32 C34 C35 = Cap_Cer_X7R_0.01uF_50V_0805: as C11 on sheet 4_analog_circuits; NCM: 8532.24.10
C36 = Cap_Cer_X7R_0.1uF_25V_0805: as C10 on sheet 4_analog_circuits; NCM: 8532.24.10
J_V5 = R0R_JUMPER_1/16W_0805: as J_PC1 on sheet 1_interface; NCM: 8533.21.20
R19 R20 = R120R_1%_1/4W_0805: RES 120R OHM 1/8W 1% 0805; Partnumber: CRGCQ0805F120R; NCM: 8533.21.20
R21-R36 = R10k_1%_1/8W_0805: as R8 on sheet 4_analog_circuits; NCM: 8533.21.20
TP51-TP63 TP68 TP69 = TEST_POINT_2: Test point
U6-U8 = TCA4311ADR: IC SIGNAL BUFFER I2C 8SOIC; Partnumber: TCA4311ADR
U10 = THVD1451DR: IC INTERFACE RS422_RS485 8SOIC; Partnumber: THVD1451DR